# Altium project EVMOMAPL137_Orcad_revg.PrjPcb (part 3 of 4)

## Sheet SH08 - OMAP-L137 EMIF A.SchDoc
size 386 x 246 mm
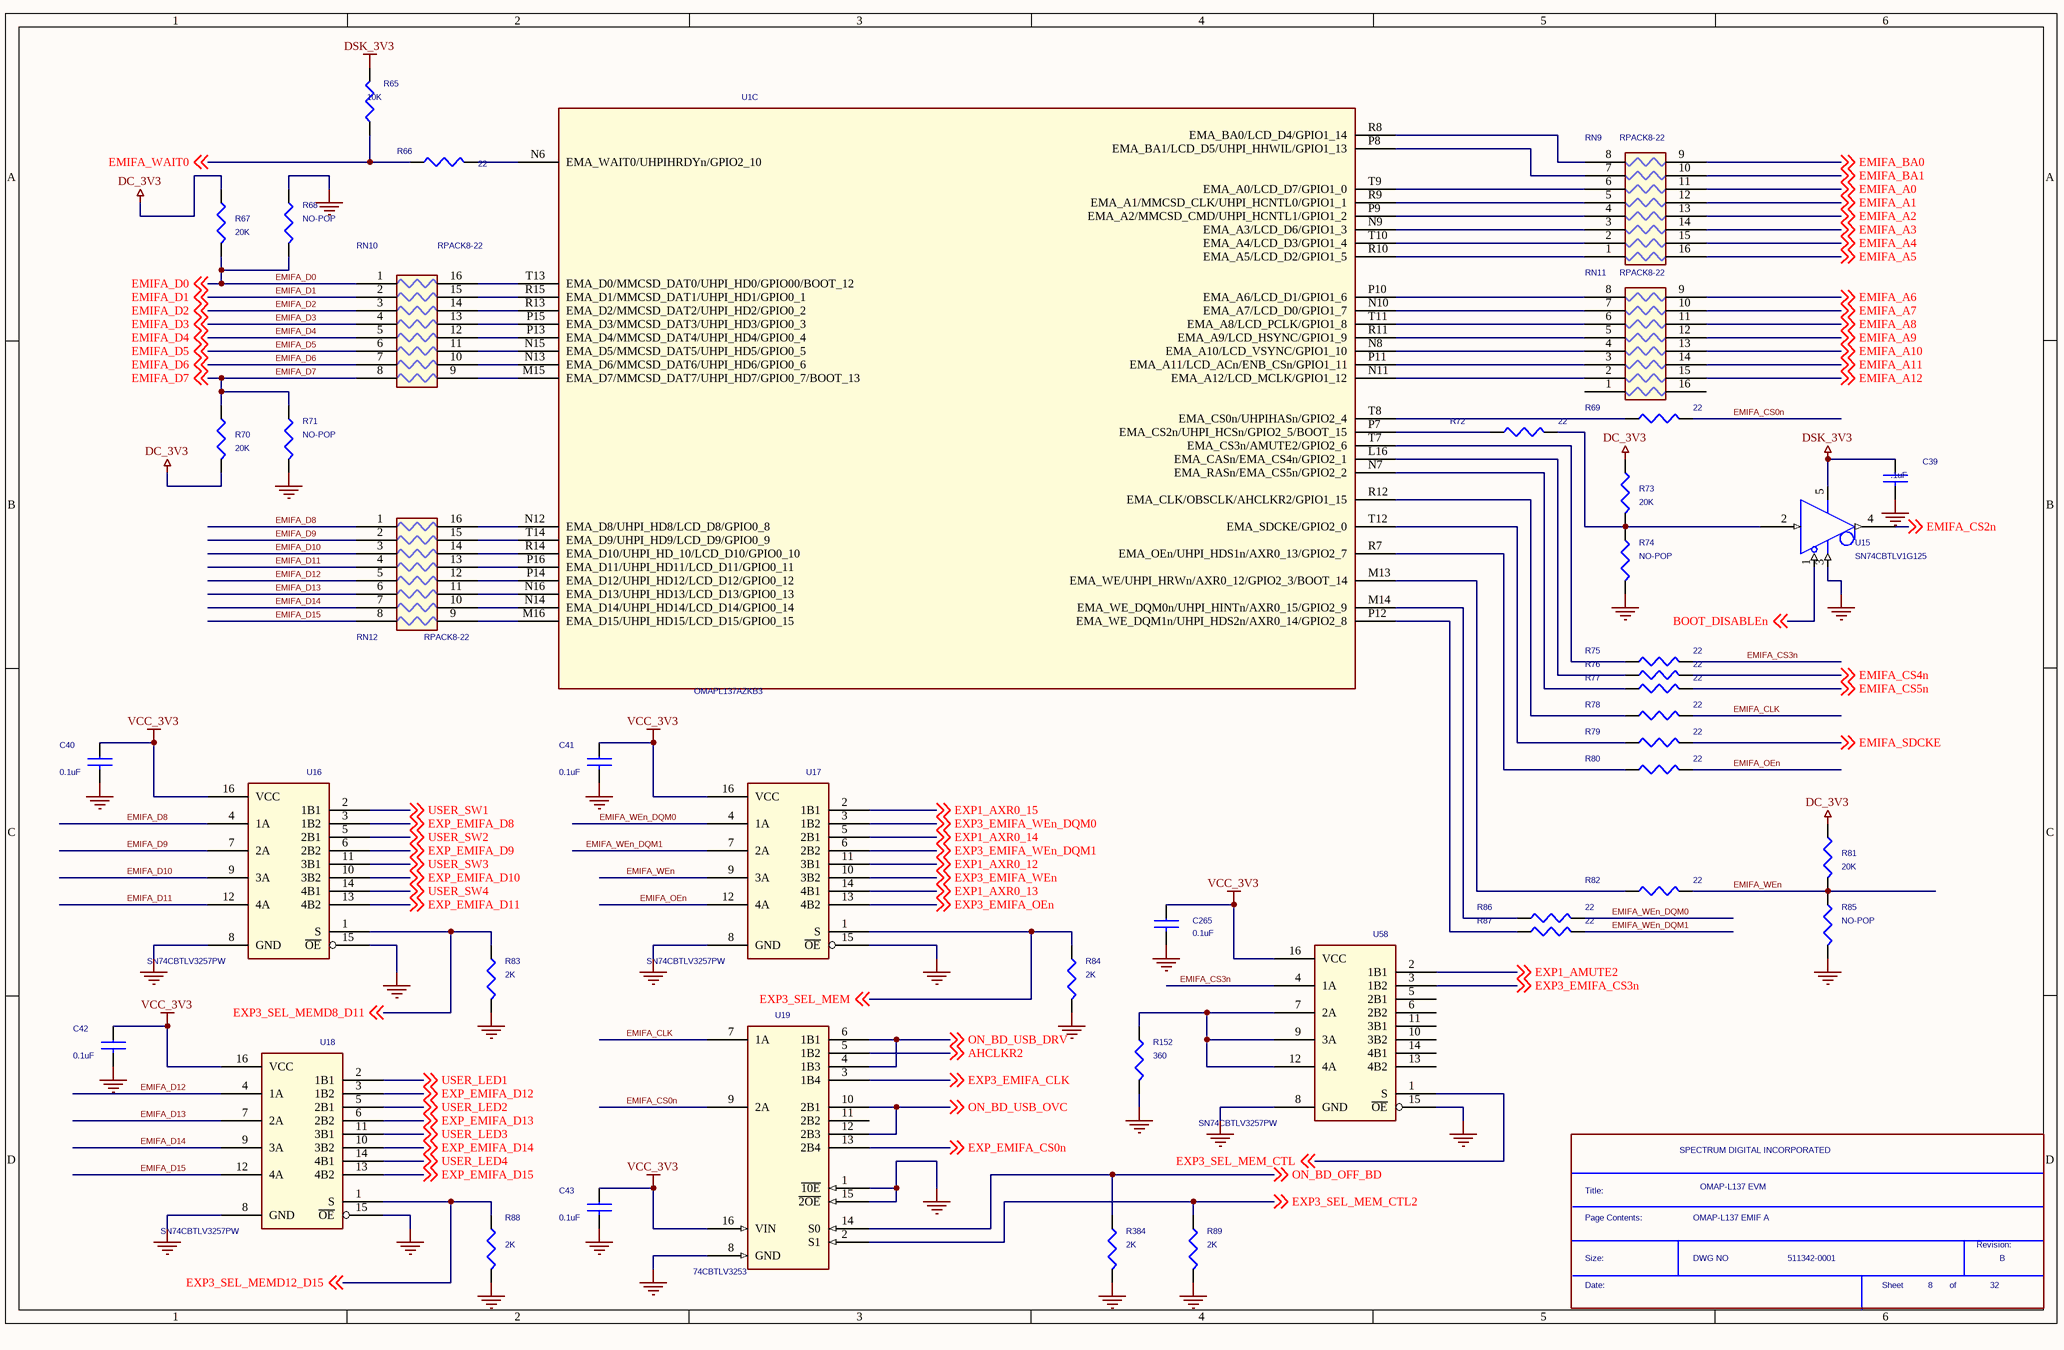
[diagram p24: SH08 - OMAP-L137 EMIF A.SchDoc]

### Parts
(Parts that share a designator on the sheet are numbered #1, #2 ... from top to bottom, then left to right.)
*#25  Page Contents:: OMAP-L137 EMIF A  RevCode: B  Title: OMAP-L137 EVM  OrgName: SPECTRUM DIGITAL INCORPORATED  Doc: 511342-0001  Page Number: 8  Page Count: 32  (hidden comment: SDTitleBlock)  (graphical)
C39  .1uF  [c402-25]
C40  0.1uF  [c402-25]
C41  0.1uF  [c402-25]
C42  0.1uF  [c402-25]
C43  0.1uF  [c402-25]
C265  0.1uF  [c402-25]
R65  10K  [r402-25]
R66  22  [r402-25]
R67  20K  [r402-25]
R68  NO-POP  [r402-25]
R69  22  [r402-25]
R70  20K  [r402-25]
R71  NO-POP  [r402-25]
R72  22  [r402-25]
R73  20K  [r402-25]
R74  NO-POP  [r402-25]
R75  22  [r402-25]
R76  22  [r402-25]
R77  22  [r402-25]
R78  22  [r402-25]
R79  22  [r402-25]
R80  22  [r402-25]
R81  20K  [r402-25]
R82  22  [r402-25]
R83  2K  [r402-25]
R84  2K  [r402-25]
R85  NO-POP  [r402-25]
R86  22  [r402-25]
R87  22  [r402-25]
R88  2K  [r402-25]
R89  2K  [r402-25]
R152  360  [r402-25]
R384  2K  [r402-25]
RN9  RPACK8-22  [rpak16-10x25-2hv]
RN10  RPACK8-22  [rpak16-10x25-2hv]
RN11  RPACK8-22  [rpak16-10x25-2hv]
RN12  RPACK8-22  [rpak16-10x25-2hv]
U1  OMAPL137AZKB3  [skt256-6064]  (part C of 9)
U15  SN74CBTLV1G125  [DCK]
U16  SN74CBTLV3257PW  [TSSOP-16]
U17  SN74CBTLV3257PW  [TSSOP-16]
U18  SN74CBTLV3257PW  [TSSOP-16]
U19  74CBTLV3253  [tssop16-14x70]
U58  SN74CBTLV3257PW  [TSSOP-16]

### Nets
DC_3V3: R67.1 R70.2 R73.1 R81.1
DSK_3V3: C39.1 R65.1 U15.5(VCC)
GND: C39.2 C40.2 C41.2 C42.2 C43.2 C265.2 R68.1 R71.2 R74.2 R83.2 R84.2 R85.2 R88.2 R89.2 R152.2 R384.2 U15.3(GND) U16.8(GND) U16.15(~{OE}) U17.8(GND) U17.15(~{OE}) U18.8(GND) U18.15(~{OE}) U19.1(~{10E}) U19.8(GND) U19.15(~{2OE}) U58.8(GND) U58.15(~{OE})
VCC_3V3: C40.1 C41.1 C42.1 C43.1 C265.1 U16.16(VCC) U17.16(VCC) U18.16(VCC) U19.16(VIN) U58.16(VCC)
AHCLKR2: U19.5(1B2) ; off-sheet AHCLKR2
BOOT_DISABLEn: U15.1(OE) ; off-sheet BOOT_DISABLEn
EMIFA_A0: RN9.11 ; off-sheet EMIFA_A0
EMIFA_A1: RN9.12 ; off-sheet EMIFA_A1
EMIFA_A2: RN9.13 ; off-sheet EMIFA_A2
EMIFA_A3: RN9.14 ; off-sheet EMIFA_A3
EMIFA_A4: RN9.15 ; off-sheet EMIFA_A4
EMIFA_A5: RN9.16 ; off-sheet EMIFA_A5
EMIFA_A6: RN11.9 ; off-sheet EMIFA_A6
EMIFA_A7: RN11.10 ; off-sheet EMIFA_A7
EMIFA_A8: RN11.11 ; off-sheet EMIFA_A8
EMIFA_A9: RN11.12 ; off-sheet EMIFA_A9
EMIFA_A10: RN11.13 ; off-sheet EMIFA_A10
EMIFA_A11: RN11.14 ; off-sheet EMIFA_A11
EMIFA_A12: RN11.15 ; off-sheet EMIFA_A12
EMIFA_BA0: RN9.9 ; off-sheet EMIFA_BA0
EMIFA_BA1: RN9.10 ; off-sheet EMIFA_BA1
EMIFA_CLK: R78.2 U19.7(1A)
EMIFA_CS0n: R69.2 U19.9(2A)
EMIFA_CS2n: U15.4(O) ; off-sheet EMIFA_CS2n
EMIFA_CS3n: R75.2 U58.4(1A)
EMIFA_CS4n: R76.2 ; off-sheet EMIFA_CS4n
EMIFA_CS5n: R77.2 ; off-sheet EMIFA_CS5n
EMIFA_D0: R67.2 R68.2 RN10.1 ; off-sheet EMIFA_D0
EMIFA_D1: RN10.2 ; off-sheet EMIFA_D1
EMIFA_D2: RN10.3 ; off-sheet EMIFA_D2
EMIFA_D3: RN10.4 ; off-sheet EMIFA_D3
EMIFA_D4: RN10.5 ; off-sheet EMIFA_D4
EMIFA_D5: RN10.6 ; off-sheet EMIFA_D5
EMIFA_D6: RN10.7 ; off-sheet EMIFA_D6
EMIFA_D7: R70.1 R71.1 RN10.8 ; off-sheet EMIFA_D7
EMIFA_D8: RN12.1 U16.4(1A)
EMIFA_D9: RN12.2 U16.7(2A)
EMIFA_D10: RN12.3 U16.9(3A)
EMIFA_D11: RN12.4 U16.12(4A)
EMIFA_D12: RN12.5 U18.4(1A)
EMIFA_D13: RN12.6 U18.7(2A)
EMIFA_D14: RN12.7 U18.9(3A)
EMIFA_D15: RN12.8 U18.12(4A)
EMIFA_OEn: R80.2 U17.12(4A)
EMIFA_SDCKE: R79.2 ; off-sheet EMIFA_SDCKE
EMIFA_WAIT0: R65.2 R66.2 ; off-sheet EMIFA_WAIT0
EMIFA_WEn: R81.2 R82.2 R85.1 U17.9(3A)
EMIFA_WEn_DQM0: R86.2 U17.4(1A)
EMIFA_WEn_DQM1: R87.2 U17.7(2A)
EXP1_AMUTE2: U58.2(1B1) ; off-sheet EXP1_AMUTE2
EXP1_AXR0_12: U17.11(3B1) ; off-sheet EXP1_AXR0_12
EXP1_AXR0_13: U17.14(4B1) ; off-sheet EXP1_AXR0_13
EXP1_AXR0_14: U17.5(2B1) ; off-sheet EXP1_AXR0_14
EXP1_AXR0_15: U17.2(1B1) ; off-sheet EXP1_AXR0_15
EXP3_EMIFA_CLK: U19.3(1B4) ; off-sheet EXP3_EMIFA_CLK
EXP3_EMIFA_CS3n: U58.3(1B2) ; off-sheet EXP3_EMIFA_CS3n
EXP3_EMIFA_OEn: U17.13(4B2) ; off-sheet EXP3_EMIFA_OEn
EXP3_EMIFA_WEn: U17.10(3B2) ; off-sheet EXP3_EMIFA_WEn
EXP3_EMIFA_WEn_DQM0: U17.3(1B2) ; off-sheet EXP3_EMIFA_WEn_DQM0
EXP3_EMIFA_WEn_DQM1: U17.6(2B2) ; off-sheet EXP3_EMIFA_WEn_DQM1
EXP3_SEL_MEM: R84.1 U17.1(S) ; off-sheet EXP3_SEL_MEM
EXP3_SEL_MEM_CTL: U58.1(S) ; off-sheet EXP3_SEL_MEM_CTL
EXP3_SEL_MEM_CTL2: R89.1 U19.2(S1) ; off-sheet EXP3_SEL_MEM_CTL2
EXP3_SEL_MEMD8_D11: R83.1 U16.1(S) ; off-sheet EXP3_SEL_MEMD8_D11
EXP3_SEL_MEMD12_D15: R88.1 U18.1(S) ; off-sheet EXP3_SEL_MEMD12_D15
EXP_EMIFA_CS0n: U19.13(2B4) ; off-sheet EXP_EMIFA_CS0n
EXP_EMIFA_D8: U16.3(1B2) ; off-sheet EXP_EMIFA_D8
EXP_EMIFA_D9: U16.6(2B2) ; off-sheet EXP_EMIFA_D9
EXP_EMIFA_D10: U16.10(3B2) ; off-sheet EXP_EMIFA_D10
EXP_EMIFA_D11: U16.13(4B2) ; off-sheet EXP_EMIFA_D11
EXP_EMIFA_D12: U18.3(1B2) ; off-sheet EXP_EMIFA_D12
EXP_EMIFA_D13: U18.6(2B2) ; off-sheet EXP_EMIFA_D13
EXP_EMIFA_D14: U18.10(3B2) ; off-sheet EXP_EMIFA_D14
EXP_EMIFA_D15: U18.13(4B2) ; off-sheet EXP_EMIFA_D15
ON_BD_OFF_BD: R384.1 U19.14(S0) ; off-sheet ON_BD_OFF_BD
ON_BD_USB_DRV: U19.4(1B3) U19.6(1B1) ; off-sheet ON_BD_USB_DRV
ON_BD_USB_OVC: U19.10(2B1) U19.12(2B3) ; off-sheet ON_BD_USB_OVC
USER_LED1: U18.2(1B1) ; off-sheet USER_LED1
USER_LED2: U18.5(2B1) ; off-sheet USER_LED2
USER_LED3: U18.11(3B1) ; off-sheet USER_LED3
USER_LED4: U18.14(4B1) ; off-sheet USER_LED4
USER_SW1: U16.2(1B1) ; off-sheet USER_SW1
USER_SW2: U16.5(2B1) ; off-sheet USER_SW2
USER_SW3: U16.11(3B1) ; off-sheet USER_SW3
USER_SW4: U16.14(4B1) ; off-sheet USER_SW4
NetR66_1: R66.1 U1.N6(EMA_WAIT0/UHPIHRDYn/GPIO2_10)
NetR69_1: R69.1 U1.T8(EMA_CS0n/UHPIHASn/GPIO2_4)
NetR72_1: R72.1 U1.P7(EMA_CS2n/UHPI_HCSn/GPIO2_5/BOOT_15)
NetR72_2: R72.2 R73.2 R74.1 U15.2(I)
NetR75_1: R75.1 U1.T7(EMA_CS3n/AMUTE2/GPIO2_6)
NetR76_1: R76.1 U1.L16(EMA_CASn/EMA_CS4n/GPIO2_1)
NetR77_1: R77.1 U1.N7(EMA_RASn/EMA_CS5n/GPIO2_2)
NetR78_1: R78.1 U1.R12(EMA_CLK/OBSCLK/AHCLKR2/GPIO1_15)
NetR79_1: R79.1 U1.T12(EMA_SDCKE/GPIO2_0)
NetR80_1: R80.1 U1.R7(EMA_OEn/UHPI_HDS1n/AXR0_13/GPIO2_7)
NetR82_1: R82.1 U1.M13(EMA_WE/UHPI_HRWn/AXR0_12/GPIO2_3/BOOT_14)
NetR86_1: R86.1 U1.M14(EMA_WE_DQM0n/UHPI_HINTn/AXR0_15/GPIO2_9)
NetR87_1: R87.1 U1.P12(EMA_WE_DQM1n/UHPI_HDS2n/AXR0_14/GPIO2_8)
NetR152_1: R152.1 U58.7(2A) U58.9(3A) U58.12(4A)
NetRN9_1: RN9.1 U1.R10(EMA_A5/LCD_D2/GPIO1_5)
NetRN9_2: RN9.2 U1.T10(EMA_A4/LCD_D3/GPIO1_4)
NetRN9_3: RN9.3 U1.N9(EMA_A3/LCD_D6/GPIO1_3)
NetRN9_4: RN9.4 U1.P9(EMA_A2/MMCSD_CMD/UHPI_HCNTL1/GPIO1_2)
NetRN9_5: RN9.5 U1.R9(EMA_A1/MMCSD_CLK/UHPI_HCNTL0/GPIO1_1)
NetRN9_6: RN9.6 U1.T9(EMA_A0/LCD_D7/GPIO1_0)
NetRN9_7: RN9.7 U1.P8(EMA_BA1/LCD_D5/UHPI_HHWIL/GPIO1_13)
NetRN9_8: RN9.8 U1.R8(EMA_BA0/LCD_D4/GPIO1_14)
NetRN10_9: RN10.9 U1.M15(EMA_D7/MMCSD_DAT7/UHPI_HD7/GPIO0_7/BOOT_13)
NetRN10_10: RN10.10 U1.N13(EMA_D6/MMCSD_DAT6/UHPI_HD6/GPIO0_6)
NetRN10_11: RN10.11 U1.N15(EMA_D5/MMCSD_DAT5/UHPI_HD5/GPIO0_5)
NetRN10_12: RN10.12 U1.P13(EMA_D4/MMCSD_DAT4/UHPI_HD4/GPIO0_4)
NetRN10_13: RN10.13 U1.P15(EMA_D3/MMCSD_DAT3/UHPI_HD3/GPIO0_3)
NetRN10_14: RN10.14 U1.R13(EMA_D2/MMCSD_DAT2/UHPI_HD2/GPIO0_2)
NetRN10_15: RN10.15 U1.R15(EMA_D1/MMCSD_DAT1/UHPI_HD1/GPIO0_1)
NetRN10_16: RN10.16 U1.T13(EMA_D0/MMCSD_DAT0/UHPI_HD0/GPIO00/BOOT_12)
NetRN11_2: RN11.2 U1.N11(EMA_A12/LCD_MCLK/GPIO1_12)
NetRN11_3: RN11.3 U1.P11(EMA_A11/LCD_ACn/ENB_CSn/GPIO1_11)
NetRN11_4: RN11.4 U1.N8(EMA_A10/LCD_VSYNC/GPIO1_10)
NetRN11_5: RN11.5 U1.R11(EMA_A9/LCD_HSYNC/GPIO1_9)
NetRN11_6: RN11.6 U1.T11(EMA_A8/LCD_PCLK/GPIO1_8)
NetRN11_7: RN11.7 U1.N10(EMA_A7/LCD_D0/GPIO1_7)
NetRN11_8: RN11.8 U1.P10(EMA_A6/LCD_D1/GPIO1_6)
NetRN12_9: RN12.9 U1.M16(EMA_D15/UHPI_HD15/LCD_D15/GPIO0_15)
NetRN12_10: RN12.10 U1.N14(EMA_D14/UHPI_HD14/LCD_D14/GPIO0_14)
NetRN12_11: RN12.11 U1.N16(EMA_D13/UHPI_HD13/LCD_D13/GPIO0_13)
NetRN12_12: RN12.12 U1.P14(EMA_D12/UHPI_HD12/LCD_D12/GPIO0_12)
NetRN12_13: RN12.13 U1.P16(EMA_D11/UHPI_HD11/LCD_D11/GPIO0_11)
NetRN12_14: RN12.14 U1.R14(EMA_D10/UHPI_HD_10/LCD_D10/GPIO0_10)
NetRN12_15: RN12.15 U1.T14(EMA_D9/UHPI_HD9/LCD_D9/GPIO0_9)
NetRN12_16: RN12.16 U1.N12(EMA_D8/UHPI_HD8/LCD_D8/GPIO0_8)

Not connected (* = marked no-connect by the designer): RN11 1 16; U19 11(2B2); U58 5(2B1) 6(2B2) 10(3B2) 11(3B1) 13(4B2) 14(4B1)

### Notes on the sheet
- (in symbol SDTitleBlock) Title:; Page Contents:; Revision:; Size:; DWG NO; Date:; Sheet; of

### Library data of the parts
C39 C265 = CAP NP_2: Part #: 101587-1100R
C40-C43 = CAP NP: Part #: 101587-1100R
R65 = R: Part #: 101370-1003R
R66 R69 R72 R75-R80 R82 R86 R87 = R: Part #: 101370-2200R
R67 R70 R73 R81 = R_1: Part #: 101370-2003R
R68 R71 R74 R85 = R_1: Part #: R0402-NOPOP
R83 R84 R88 R89 R384 = R: Part #: 101370-2002R
R152 = R: Part #: 101370-3601R
RN9-RN12 = RESISTOR DIP 8_0: Part #: 101069-2200R
U1 = PRIMUS_BGA_1: Part #: 102772-0001; SWAP_INFO: (S1+S2+S3+S4+S5+S6+S7+S8+S9); SPLIT_INST: TRUE
U15 = SN74LVC1G125: Part #: 101689-0125R
U16-U18 U58 = SN74CBT3257PW: IC, Quad 2-1 Multiplexer; Part #: 101670-0001R; Mfg: TI
U19 = 74CBTLV253_0: Part #: 101433-0001R

## Sheet SH07 - OMAP-L137 USB1.SchDoc
size 386 x 246 mm
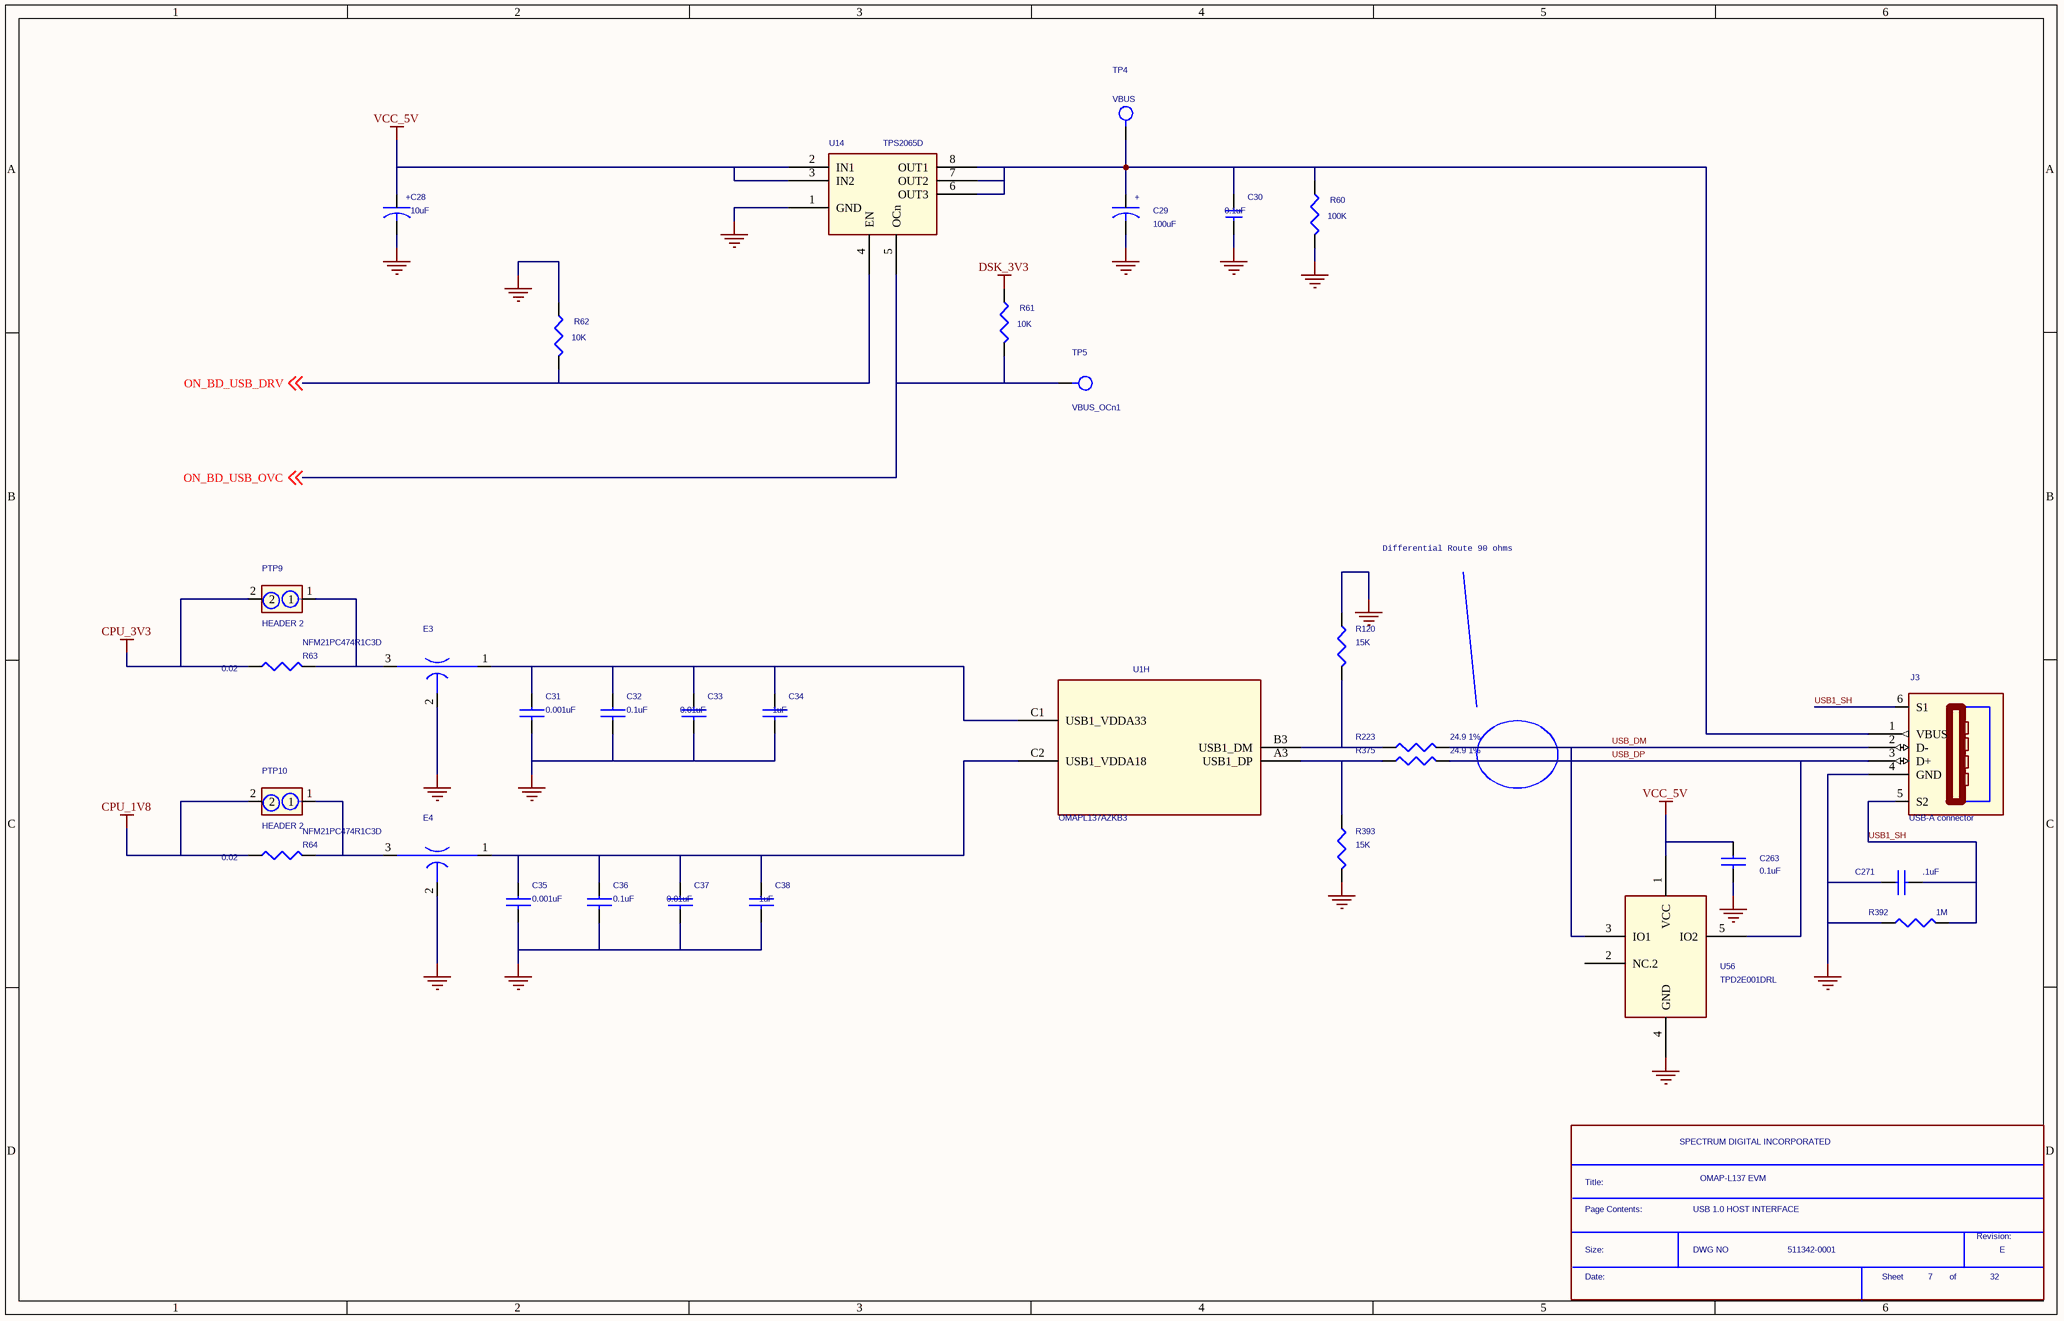
[diagram p25: SH07 - OMAP-L137 USB1.SchDoc]

### Parts
(Parts that share a designator on the sheet are numbered #1, #2 ... from top to bottom, then left to right.)
*#26  Page Contents:: USB 1.0 HOST INTERFACE  RevCode: E  Title: OMAP-L137 EVM  OrgName: SPECTRUM DIGITAL INCORPORATED  Doc: 511342-0001  Page Number: 7  Page Count: 32  (hidden comment: SDTitleBlock)  (graphical)
C28  10uF  [EIA-A]
C29  100uF  [EIA-A]
C30  0.1uF  [0603]
C31  0.001uF  [c402-25]
C32  0.1uF  [c402-25]
C33  0.01uF  [c402-25]
C34  1uF  [c603-35x45]
C35  0.001uF  [c402-25]
C36  0.1uF  [c402-25]
C37  0.01uF  [c402-25]
C38  1uF  [c603-35x45]
C263  0.1uF  [c402-25]
C271  .1uF  [C0603]
E3  NFM21PC474R1C3D  [emi-NFM21p]
E4  NFM21PC474R1C3D  [emi-NFM21p]
J3  USB-A connector  [USB-B]
PTP9  HEADER 2  [JUMP1X2-6040]
PTP10  HEADER 2  [JUMP1X2-6040]
R60  100K  [r402-25]
R61  10K  [r402-25]
R62  10K  [r402-25]
R63  0.02  [r1206-40x70]
R64  0.02  [r1206-40x70]
R120  15K  [r402-25]
R223  24.9 1%  [r402-25]
R375  24.9 1%  [r402-25]
R392  1M  [r603-35x45]
R393  15K  [r402-25]
TP4  VBUS  [tp1-6040]
TP5  VBUS_OCn1  [tp1-6040]
U1  OMAPL137AZKB3  [skt256-6064]  (part H of 9)
U14  TPS2065D  [so8-25x75]
U56  TPD2E001DRL  [drl5-12x40]

### Nets
CPU_1V8: PTP10.2 R64.2
CPU_3V3: PTP9.2 R63.2
DSK_3V3: R61.1
GND: C28.2 C29.2 C30.2 C31.2 C32.2 C33.2 C34.2 C35.2 C36.2 C37.2 C38.2 C263.2 C271.1 E3.2 E4.2 J3.4(GND) R60.2 R62.1 R120.1 R392.1 R393.2 U14.1(GND) U56.4(GND)
VCC_5V: C28.1 C263.1 U14.2(IN1) U14.3(IN2) U56.1(VCC)
ON_BD_USB_DRV: R62.2 U14.4(EN) ; off-sheet ON_BD_USB_DRV
ON_BD_USB_OVC: R61.2 TP5.1(PIN) U14.5(OCn) ; off-sheet ON_BD_USB_OVC
USB1_SH: C271.2 J3.5(S2) J3.6(S1) R392.2
USB_DM: J3.2(D-) R223.2 U56.3(IO1)
USB_DP: J3.3(D+) R375.2 U56.5(IO2)
NetC29_1: C29.1 C30.1 J3.1(VBUS) R60.1 TP4.1(PIN) U14.6(OUT3) U14.7(OUT2) U14.8(OUT1)
NetC31_1: C31.1 C32.1 C33.1 C34.1 E3.1 U1.C1(USB1_VDDA33)
NetC35_1: C35.1 C36.1 C37.1 C38.1 E4.1 U1.C2(USB1_VDDA18)
NetE3_3: E3.3 PTP9.1 R63.1
NetE4_3: E4.3 PTP10.1 R64.1
NetR120_2: R120.2 R223.1 U1.B3(USB1_DM)
NetR375_1: R375.1 R393.1 U1.A3(USB1_DP)

Not connected (* = marked no-connect by the designer): U56 2(NC.2)

### Notes on the sheet
- Differential Route 90 ohms
- (in symbol Cap 4_1.7uF Tan 10V 20% EIA_A) +
- (in symbol SDTitleBlock) Title:; Page Contents:; Revision:; Size:; DWG NO; Date:; Sheet; of

### Library data of the parts
C28 = Cap 4_1.7uF Tan 10V 20% EIA_A: 4.7uF Capacitor, Tantalum, 10V, 20%; NCPartnumber: EIA_A; Mfr: Panasonic; PartName: Cap 4.7uF Tan 10V 20% EIA_A; MfrNum: ECS-T1AY475R; Part #: 101003-0101R; Cost10K: 0.257; Cost100: 0.418; Vendor: xxxx; VendorNum: PCS2475CT-ND; SD PCB Footprint: EIA1206
C29 = Cap 4_1.7uF Tan 10V 20% EIA_A: 4.7uF Capacitor, Tantalum, 10V, 20%; NCPartnumber: EIA_A; Mfr: Panasonic; PartName: Cap 4.7uF Tan 10V 20% EIA_A; MfrNum: ECS-T1AY475R; Part #: 101608-0102R; Cost10K: 0.257; Cost100: 0.418; Vendor: xxxx; VendorNum: PCS2475CT-ND; SD PCB Footprint: EIA1206
C30 = Cap 100nF Cermc 16V 10% 603: 0.1uF Capacitor, Ceramic, 16V, 10%, 0603; MfrNum: ECJ-1VB1C104K; Mfr: Panasonic; NCPartnumber: 1C0056; Part #: 101587-1100R; VendorNum: PCC1762CT-ND; Vendor: Digikey; Cost100: 0.0694; Cost10K: 0.038; TI Footprint: c603-35x45; SD PCB Footprint: EIA0402; PartName: Cap 100nF Cermc 16V 10% 603
C31 C35 = CAP NP: Part #: 102058-1102R
C32 C36 = CAP NP: Part #: 101587-1100R
C33 C37 = CAP NP: Part #: 101587-1101R
C34 C38 = CAP NP: Part #: 101007-0100R
C263 = CAP NP_0: Part #: 101587-1100R
C271 = CAP .1 uF 10% 0603: Part #: 101587-1100R
E3 E4 = NFM_1: Part #: 102569-1470R
J3 = USB-A connector: USB Device Connector Right Angle PCB Mount; PartName: USB  Connector; Mfr: AMP; MfrNum: 787780-1; Part #: 101678-0001R; Vendor: Digikey; VendorNum: 787780-1-ND
PTP9 PTP10 = PTP2: Single Line Header 2pin Tin; NCPartnumber: 2H0000; MfrNum: PTC02SAAN; Mfr: Sullins; Cost10K: 0.252; Vendor: Digikey; Cost100: 0.252; PartName: HEADER2Pin
R60 = R: Part #: 101370-1004R
R61 R62 = R: Part #: 101370-1003R
R63 R64 = R: Part #: 102598-0002R
R120 R393 = R
R223 R375 = R: Part #: 102145-2490R
R392 = R: Part #: 100642-1005R
TP4 = Test Point_1: TEST POINT 0.100; PartName: HEADER 1; Part #: 100115-0001R; Mfr: Sullins; MfrNum: PZC36DAAN; Vendor: Digikey; Vendor Nbr: S2111-36-ND; SD PCB Footprint: CON1; Assy_NO-POP: Do Not Populate; VendorNum: S2011-36-ND; Cost100: 0.031; Cost10K: 0.018; ION Footprint: tp1-6040; TI Footprint: tp1-6040
TP5 = Test Point_1: TEST POINT 0.100; PartName: HEADER 1; MfrNum: PZC36DAAN; Mfr: Sullins; Part #: 100115-0001R; Vendor: Digikey; Vendor Nbr: S2111-36-ND; Cost10K: 0.018; Cost100: 0.031; VendorNum: S2011-36-ND; Assy_NO-POP: Do Not Populate; SD PCB Footprint: CON1; TI Footprint: tp1-6040; ION Footprint: tp1-6040
U1 = PRIMUS_BGA_1: as U1 on sheet SH08 - OMAP-L137 EMIF A
U14 = tps2061_1: Part #: 102810-0001R
U56 = TPDE0001RSE_0: Part #: 102728-0001R

## Sheet SH06 - OMAP-L137 USB2.SchDoc
size 386 x 246 mm
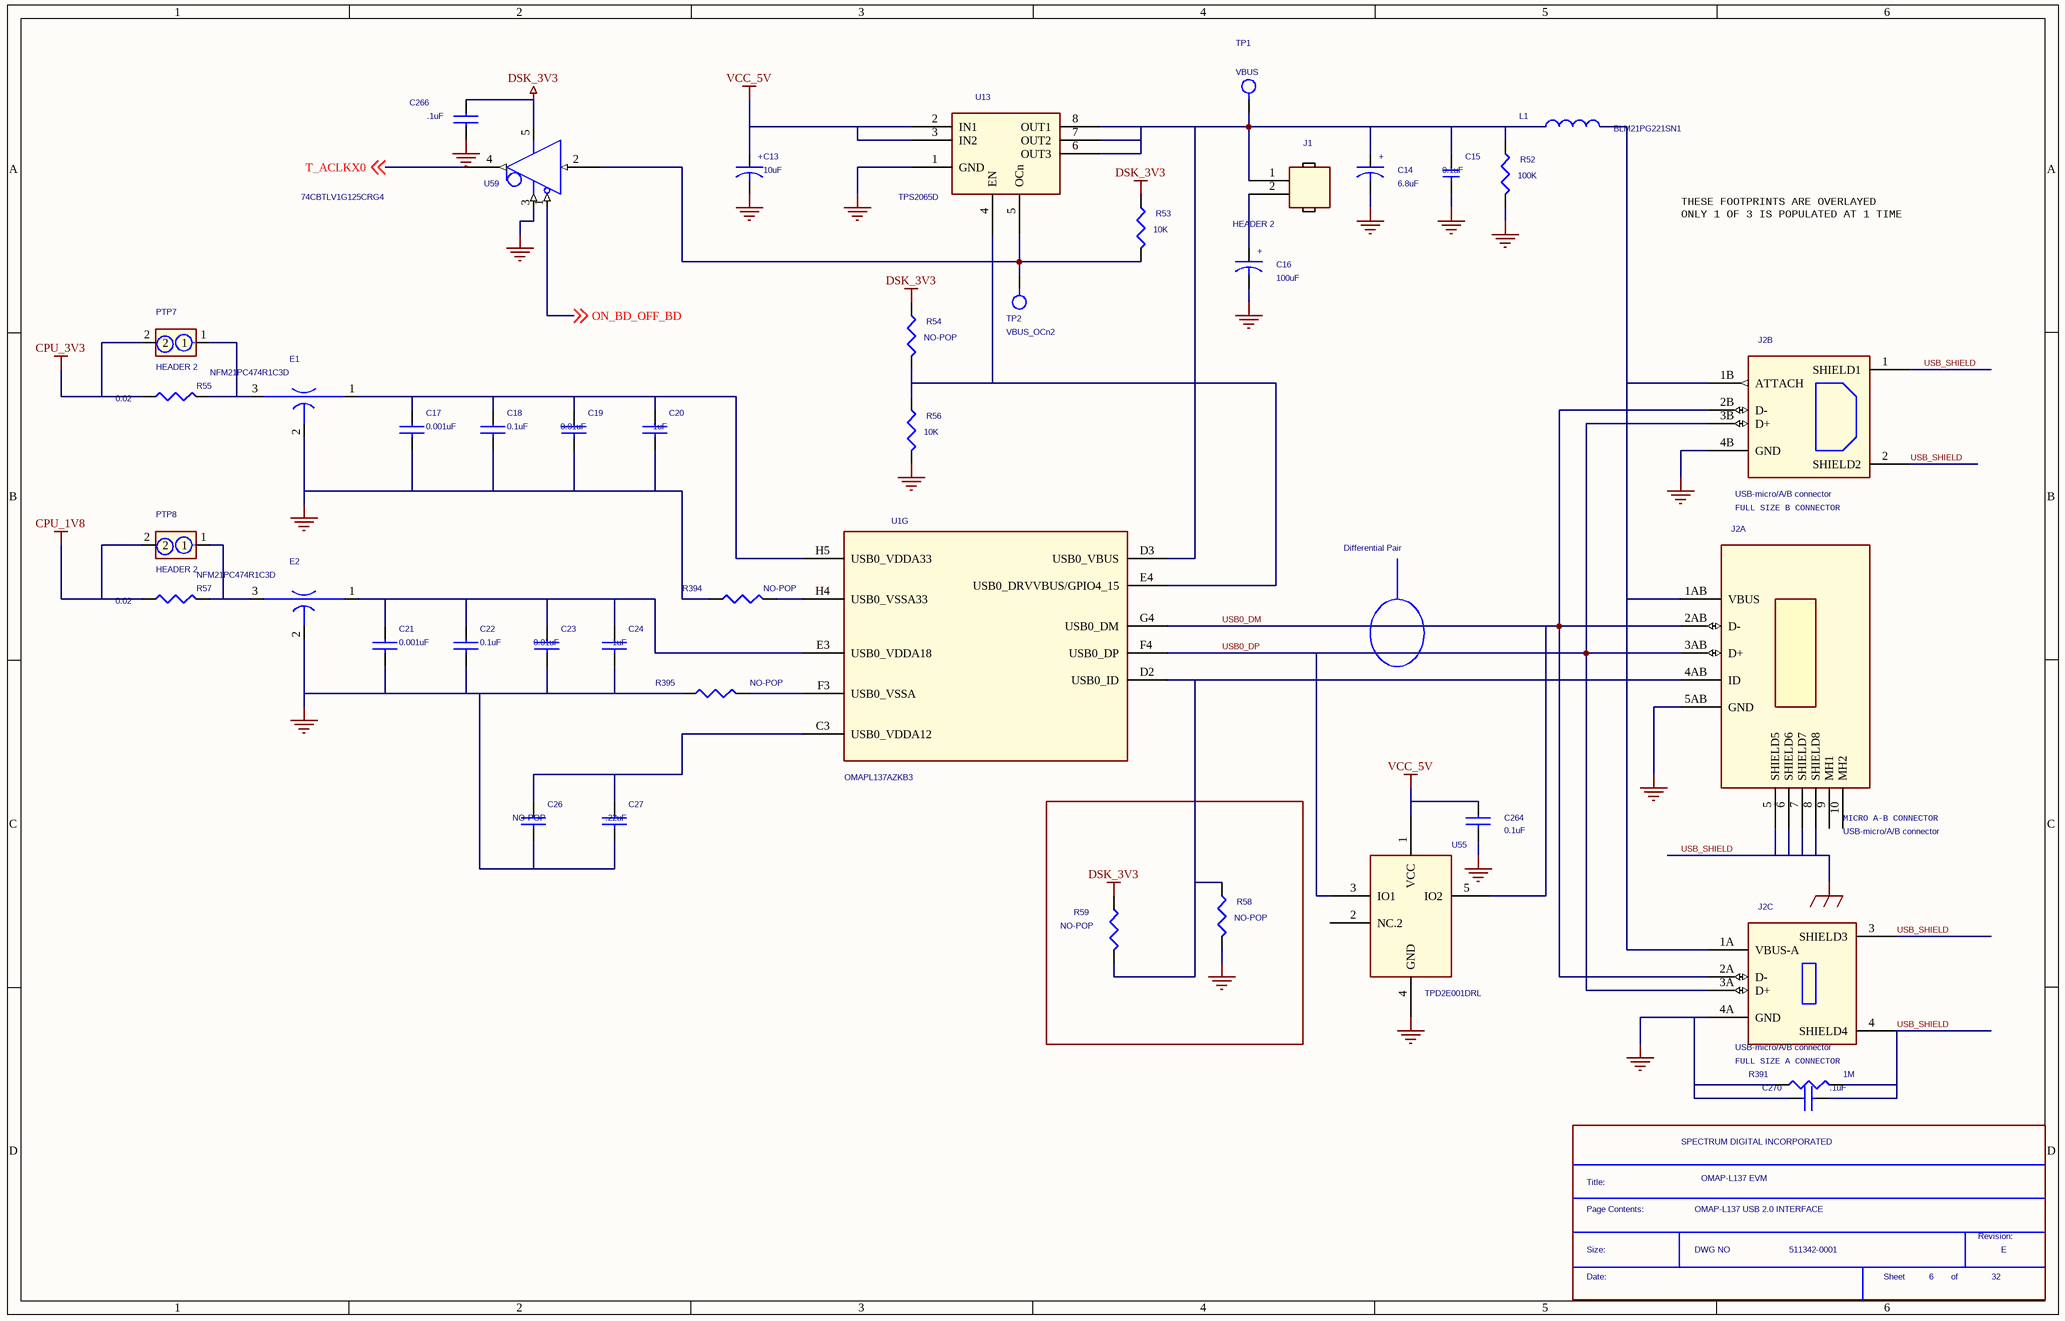
[diagram p26: SH06 - OMAP-L137 USB2.SchDoc]

### Parts
(Parts that share a designator on the sheet are numbered #1, #2 ... from top to bottom, then left to right.)
*#27  Page Contents:: OMAP-L137 USB 2.0 INTERFACE  RevCode: E  Title: OMAP-L137 EVM  OrgName: SPECTRUM DIGITAL INCORPORATED  Doc: 511342-0001  Page Number: 6  Page Count: 32  (hidden comment: SDTitleBlock)  (graphical)
C13  10uF  [EIA-A]
C14  6.8uF  [EIA-A]
C15  0.1uF  [0603]
C16  100uF  [EIA-A]
C17  0.001uF  [c402-25]
C18  0.1uF  [c402-25]
C19  0.01uF  [c402-25]
C20  1uF  [c603-35x45]
C21  0.001uF  [c402-25]
C22  0.1uF  [c402-25]
C23  0.01uF  [c402-25]
C24  1uF  [c603-35x45]
C26  NO-POP  [c402-25]
C27  .22uF  [c603-35x45]
C264  0.1uF  [c402-25]
C266  .1uF  [c402-25]
C270  .1uF  [C0603]
E1  NFM21PC474R1C3D  [emi-NFM21p]
E2  NFM21PC474R1C3D  [emi-NFM21p]
J1  HEADER 2  [JUMP1X2-6040]
J2  USB-micro/A/B connector  [usb_tripl-rev2]  (parts A,B,C of 3)
L1  BLM21PG221SN1  [l805-35x60]
PTP7  HEADER 2  [JUMP1X2-6040]
PTP8  HEADER 2  [JUMP1X2-6040]
R52  100K  [r402-25]
R53  10K  [r402-25]
R54  NO-POP  [r402-25]
R55  0.02  [r1206-40x70]
R56  10K  [r402-25]
R57  0.02  [r1206-40x70]
R58  NO-POP  [r402-25]
R59  NO-POP  [r402-25]
R391  1M  [r603-35x45]
R394  NO-POP  [r402-25]
R395  NO-POP  [r402-25]
TP1  VBUS  [tp1-6040]
TP2  VBUS_OCn2  [tp1-6040]
U1  OMAPL137AZKB3  [skt256-6064]  (part G of 9)
U13  TPS2065D  [so8-25x75]
U55  TPD2E001DRL  [drl5-12x40]
U59  74CBTLV1G125CRG4  [DCK]

### Nets
CPU_1V8: PTP8.2 R57.2
CPU_3V3: PTP7.2 R55.2
DSK_3V3: C266.1 R53.1 R54.1 R59.1 U59.5(VCC)
GND: C13.2 C14.2 C15.2 C16.2 C17.2 C18.2 C19.2 C20.2 C21.2 C22.2 C23.2 C24.2 C26.2 C27.2 C264.2 C266.2 C270.1 E1.2 E2.2 J2.4A(GND) J2.4B(GND) J2.5AB(GND) R52.2 R56.2 R58.2 R391.1 R394.1 R395.1 U13.1(GND) U55.4(GND) U59.3(GND)
USB_SHIELD: C270.2 J2.1(SHIELD1) J2.2(SHIELD2) J2.3(SHIELD3) J2.4(SHIELD4) J2.5(SHIELD5) J2.6(SHIELD6) J2.7(SHIELD7) J2.8(SHIELD8) R391.2  [also labelled GND_EARTH]
VCC_5V: C13.1 C264.1 U13.2(IN1) U13.3(IN2) U55.1(VCC)
ON_BD_OFF_BD: U59.1(OE) ; off-sheet ON_BD_OFF_BD
T_ACLKX0: U59.4(O) ; off-sheet T_ACLKX0
USB0_DM: J2.2A(D-) J2.2AB(D-) J2.2B(D-) U1.G4(USB0_DM) U55.5(IO2)
USB0_DP: J2.3A(D+) J2.3AB(D+) J2.3B(D+) U1.F4(USB0_DP) U55.3(IO1)
NetC14_1: C14.1 C15.1 J1.1 L1.2 R52.1 TP1.1(PIN) U1.D3(USB0_VBUS) U13.6(OUT3) U13.7(OUT2) U13.8(OUT1)
NetC16_1: C16.1 J1.2
NetC17_1: C17.1 C18.1 C19.1 C20.1 E1.1 U1.H5(USB0_VDDA33)
NetC21_1: C21.1 C22.1 C23.1 C24.1 E2.1 U1.E3(USB0_VDDA18)
NetC26_1: C26.1 C27.1 U1.C3(USB0_VDDA12)
NetE1_3: E1.3 PTP7.1 R55.1
NetE2_3: E2.3 PTP8.1 R57.1
NetJ2_1A: J2.1A(VBUS-A) J2.1AB(VBUS) J2.1B(ATTACH) L1.1
NetJ2_4AB: J2.4AB(ID) R58.1 R59.2 U1.D2(USB0_ID)
NetR53_2: R53.2 TP2.1(PIN) U13.5(OCn) U59.2(I)
NetR54_2: R54.2 R56.1 U1.E4(USB0_DRVVBUS/GPIO4_15) U13.4(EN)
NetR394_2: R394.2 U1.H4(USB0_VSSA33)
NetR395_2: R395.2 U1.F3(USB0_VSSA)

Not connected (* = marked no-connect by the designer): J2 9(MH1) 10(MH2); U55 2(NC.2)

### Notes on the sheet
- THESE FOOTPRINTS ARE OVERLAYED
  ONLY 1 OF 3 IS POPULATED AT 1 TIME
- (near J2) FULL SIZE B CONNECTOR
- Differential Pair
- (near J2) MICRO A-B CONNECTOR
- FULL SIZE A CONNECTOR
- (in symbol Cap 4_1.7uF Tan 10V 20% EIA_A) +
- (in symbol SDTitleBlock) Title:; Page Contents:; Revision:; Size:; DWG NO; Date:; Sheet; of

### Library data of the parts
C13 = Cap 4_1.7uF Tan 10V 20% EIA_A: as C28 on sheet SH07 - OMAP-L137 USB1
C14 = Cap 4_1.7uF Tan 10V 20% EIA_A: 4.7uF Capacitor, Tantalum, 10V, 20%; NCPartnumber: EIA_A; Mfr: Panasonic; PartName: Cap 4.7uF Tan 10V 20% EIA_A; MfrNum: ECS-T1AY475R; Part #: 102359-0680R; Cost10K: 0.257; Cost100: 0.418; Vendor: xxxx; VendorNum: PCS2475CT-ND; SD PCB Footprint: EIA1206
C15 = Cap 100nF Cermc 16V 10% 603: as C30 on sheet SH07 - OMAP-L137 USB1; PartName: Cap 100nF Cermc 16V 10% 603
C16 = Cap 4_1.7uF Tan 10V 20% EIA_A: as C29 on sheet SH07 - OMAP-L137 USB1
C17 C21 = CAP NP: Part #: 102058-1102R
C18 C22 = CAP NP: Part #: 101587-1100R
C19 C23 = CAP NP: Part #: 101587-1101R
C20 C24 = CAP NP: Part #: 101007-0100R
C26 = CAP NP: Part #: C0402-NOPOP
C27 = CAP NP: Part #: 101005-1220R
C264 = CAP NP_0: Part #: 101587-1100R
C266 = CAP NP_2: Part #: 101587-1100R
C270 = CAP .1 uF 10% 0603: Part #: 101587-1100R
E1 E2 = NFM_1: Part #: 102569-1470R
J1 = HEADER 2: Part #: 100115-0002R
J2 = USBCONN3_0: Part #: 102836-0001R
L1 = INDUCTOR_3: Part #: 101228-2201R
PTP7 PTP8 = PTP2: as PTP9 on sheet SH07 - OMAP-L137 USB1; Cost100: 0.252; PartName: HEADER2Pin
R52 = R: Part #: 101370-1004R
R53 R56 = R: Part #: 101370-1003R
R54 R58 R59 = R: Part #: R0402-NOPOP
R55 R57 = R: Part #: 102598-0002R
R391 = R: Part #: 100642-1005R
R394 R395 = R
TP1 = Test Point_1: as TP5 on sheet SH07 - OMAP-L137 USB1; TI Footprint: tp1-6040; ION Footprint: tp1-6040
TP2 = Test Point_1: as TP4 on sheet SH07 - OMAP-L137 USB1; ION Footprint: tp1-6040; TI Footprint: tp1-6040
U1 = PRIMUS_BGA_1: as U1 on sheet SH08 - OMAP-L137 EMIF A
U13 = tps2061_1: Part #: 102810-0001R
U55 = TPDE0001RSE_0: Part #: 102728-0001R
U59 = SN74LVC1G125: Part #: 101689-0125R

## Sheet SH05 - SPI MUXING.SchDoc
size 386 x 246 mm
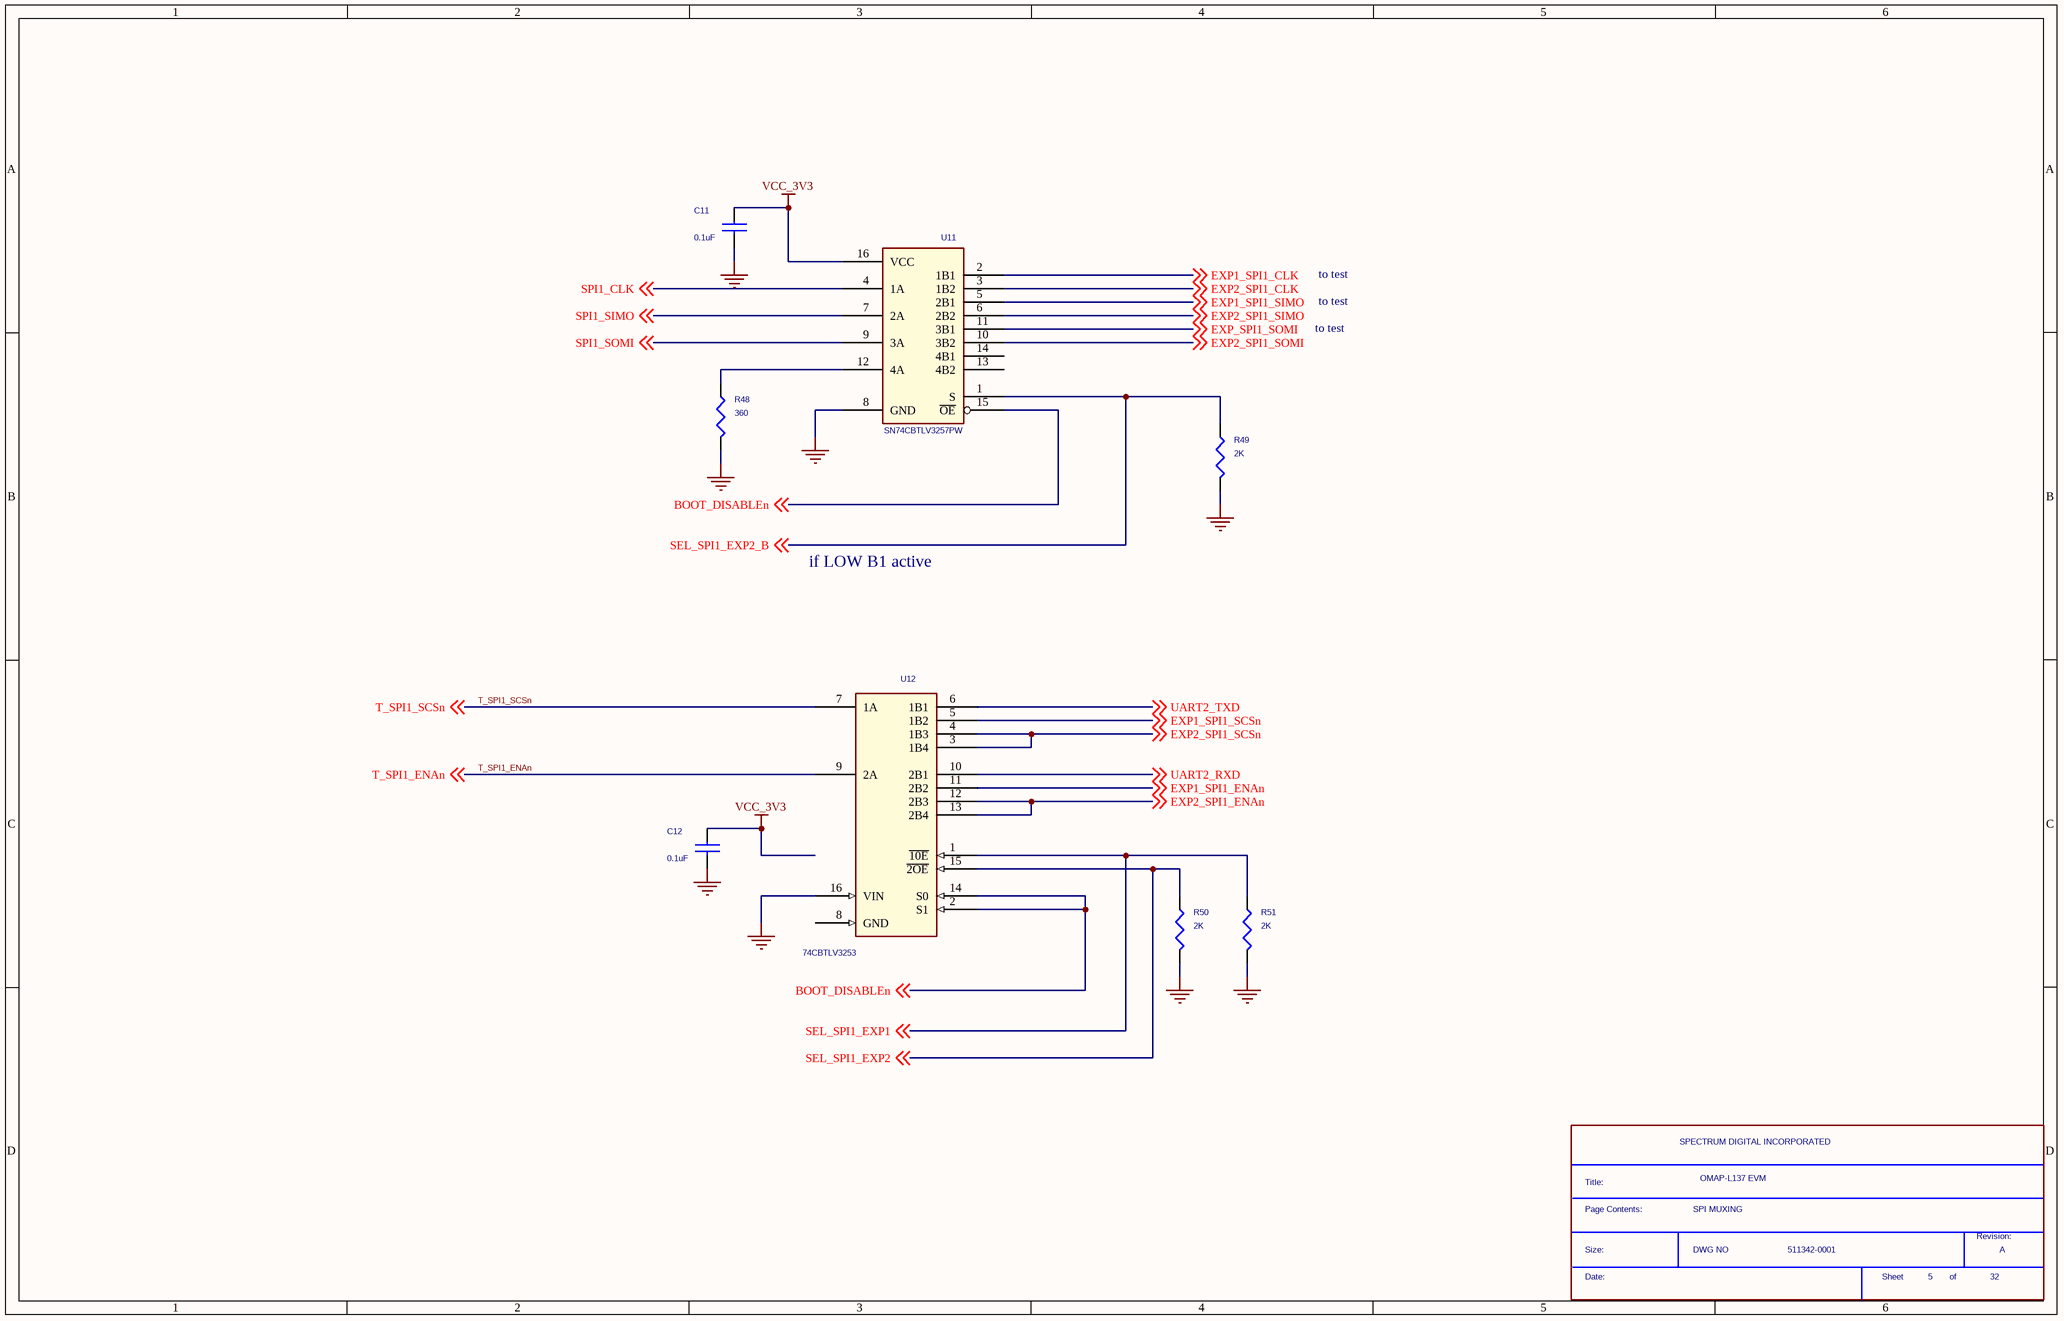
[diagram p27: SH05 - SPI MUXING.SchDoc]

### Parts
(Parts that share a designator on the sheet are numbered #1, #2 ... from top to bottom, then left to right.)
*#28  Page Contents:: SPI MUXING  RevCode: A  Title: OMAP-L137 EVM  OrgName: SPECTRUM DIGITAL INCORPORATED  Doc: 511342-0001  Page Number: 5  Page Count: 32  (hidden comment: SDTitleBlock)  (graphical)
C11  0.1uF  [c402-25]
C12  0.1uF  [c402-25]
R48  360  [r402-25]
R49  2K  [r402-25]
R50  2K  [r402-25]
R51  2K  [r402-25]
U11  SN74CBTLV3257PW  [TSSOP-16]
U12  74CBTLV3253  [tssop16-14x70]

### Nets
GND: C11.2 C12.2 R48.2 R49.2 R50.2 R51.2 U11.8(GND) U12.16(VIN)
VCC_3V3: C11.1 C12.1 U11.16(VCC)
BOOT_DISABLEn: U11.15(~{OE}) U12.2(S1) U12.14(S0) ; off-sheet BOOT_DISABLEn
EXP1_SPI1_CLK: U11.2(1B1) ; off-sheet EXP1_SPI1_CLK
EXP1_SPI1_ENAn: U12.11(2B2) ; off-sheet EXP1_SPI1_ENAn
EXP1_SPI1_SCSn: U12.5(1B2) ; off-sheet EXP1_SPI1_SCSn
EXP1_SPI1_SIMO: U11.5(2B1) ; off-sheet EXP1_SPI1_SIMO
EXP2_SPI1_CLK: U11.3(1B2) ; off-sheet EXP2_SPI1_CLK
EXP2_SPI1_ENAn: U12.12(2B3) U12.13(2B4) ; off-sheet EXP2_SPI1_ENAn
EXP2_SPI1_SCSn: U12.3(1B4) U12.4(1B3) ; off-sheet EXP2_SPI1_SCSn
EXP2_SPI1_SIMO: U11.6(2B2) ; off-sheet EXP2_SPI1_SIMO
EXP2_SPI1_SOMI: U11.10(3B2) ; off-sheet EXP2_SPI1_SOMI
EXP_SPI1_SOMI: U11.11(3B1) ; off-sheet EXP_SPI1_SOMI
SEL_SPI1_EXP1: R51.1 U12.1(~{10E}) ; off-sheet SEL_SPI1_EXP1
SEL_SPI1_EXP2: R50.1 U12.15(~{2OE}) ; off-sheet SEL_SPI1_EXP2
SEL_SPI1_EXP2_B: R49.1 U11.1(S) ; off-sheet SEL_SPI1_EXP2_B
SPI1_CLK: U11.4(1A) ; off-sheet SPI1_CLK  [project net BOOTMODE[7]]
SPI1_SIMO: U11.7(2A) ; off-sheet SPI1_SIMO
SPI1_SOMI: U11.9(3A) ; off-sheet SPI1_SOMI
T_SPI1_ENAn: U12.9(2A) ; off-sheet T_SPI1_ENAn
T_SPI1_SCSn: U12.7(1A) ; off-sheet T_SPI1_SCSn
UART2_RXD: U12.10(2B1) ; off-sheet UART2_RXD
UART2_TXD: U12.6(1B1) ; off-sheet UART2_TXD
NetR48_1: R48.1 U11.12(4A)

Not connected (* = marked no-connect by the designer): U11 13(4B2) 14(4B1); U12 8(GND)

### Notes on the sheet
- to test
- if LOW B1 active
- (in symbol SDTitleBlock) Title:; Page Contents:; Revision:; Size:; DWG NO; Date:; Sheet; of

### Library data of the parts
C11 C12 = CAP NP: Part #: 101587-1100R
R48 = R: Part #: 101370-3601R
R49-R51 = R: Part #: 101370-2002R
U11 = SN74CBT3257PW: as U16 on sheet SH08 - OMAP-L137 EMIF A
U12 = 74CBTLV253_0: Part #: 101433-0001R

## Sheet SH04 - OMAP-L137 SERIAL.SchDoc
size 386 x 246 mm
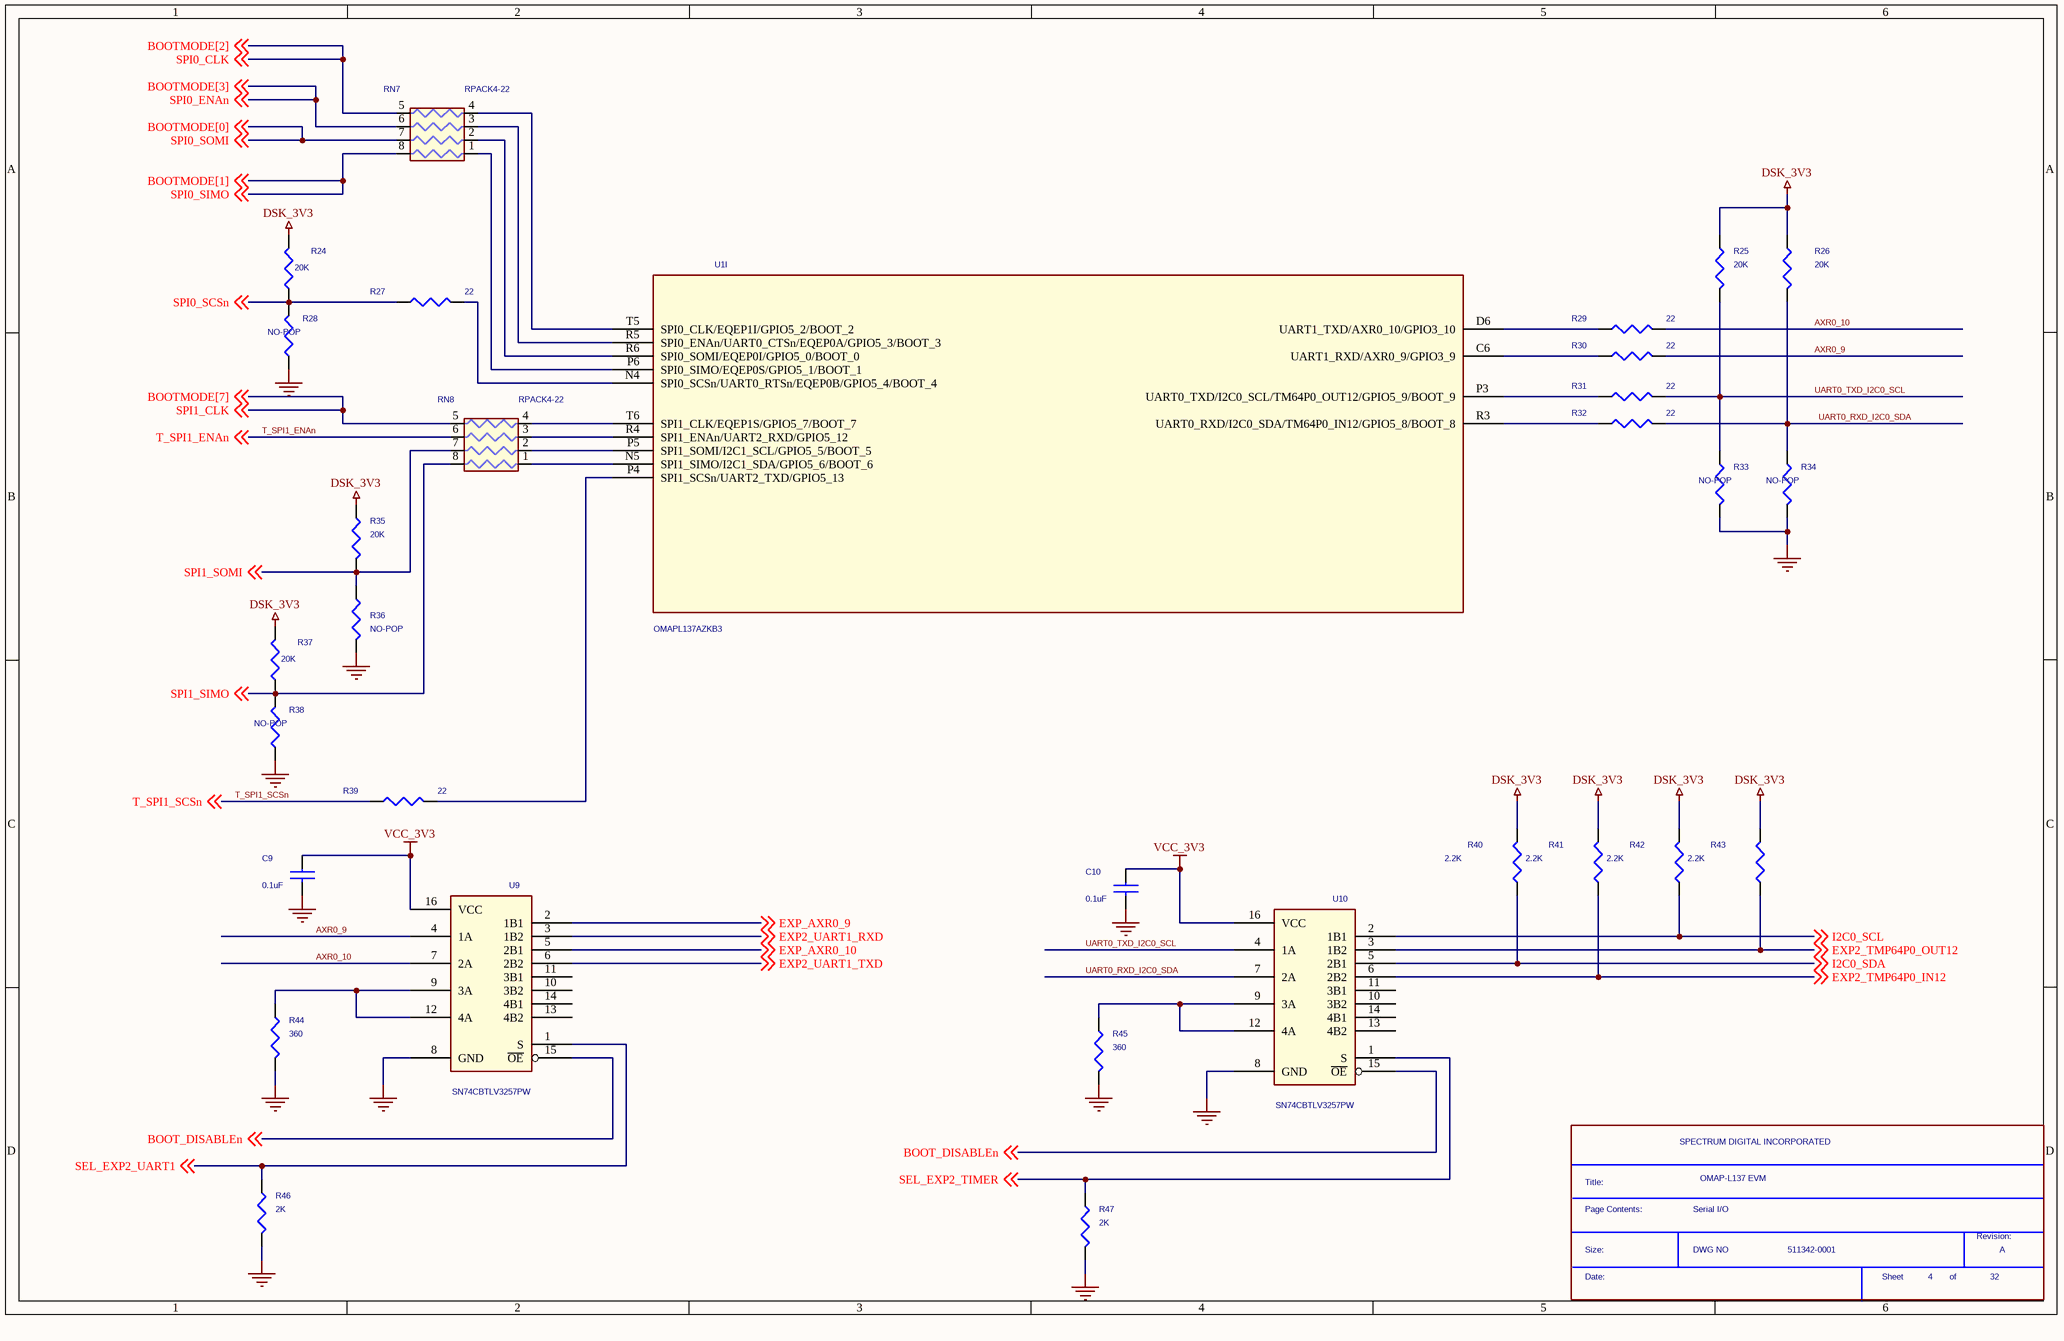
[diagram p28: SH04 - OMAP-L137 SERIAL.SchDoc]

### Parts
(Parts that share a designator on the sheet are numbered #1, #2 ... from top to bottom, then left to right.)
*#29  Page Contents:: Serial I/O  RevCode: A  Title: OMAP-L137 EVM  OrgName: SPECTRUM DIGITAL INCORPORATED  Doc: 511342-0001  Page Number: 4  Page Count: 32  (hidden comment: SDTitleBlock)  (graphical)
C9  0.1uF  [c402-25]
C10  0.1uF  [c402-25]
R24  20K  [r402-25]
R25  20K  [r402-25]
R26  20K  [r402-25]
R27  22  [r402-25]
R28  NO-POP  [r402-25]
R29  22  [r402-25]
R30  22  [r402-25]
R31  22  [r402-25]
R32  22  [r402-25]
R33  NO-POP  [r402-25]
R34  NO-POP  [r402-25]
R35  20K  [r402-25]
R36  NO-POP  [r402-25]
R37  20K  [r402-25]
R38  NO-POP  [r402-25]
R39  22  [r402-25]
R40  2.2K  [r402-25]
R41  2.2K  [r402-25]
R42  2.2K  [r402-25]
R43  2.2K  [r402-25]
R44  360  [r402-25]
R45  360  [r402-25]
R46  2K  [r402-25]
R47  2K  [r402-25]
RN7  RPACK4-22  [rpak8-10x25-28v]
RN8  RPACK4-22  [rpak8-10x25-28v]
U1  OMAPL137AZKB3  [skt256-6064]  (part I of 9)
U9  SN74CBTLV3257PW  [TSSOP-16]
U10  SN74CBTLV3257PW  [TSSOP-16]

### Nets
DSK_3V3: R24.1 R25.1 R26.1 R35.1 R37.1 R40.1 R41.1 R42.1 R43.1
GND: C9.2 C10.2 R28.2 R33.1 R34.1 R36.2 R38.2 R44.2 R45.2 R46.2 R47.2 U9.8(GND) U10.8(GND)
VCC_3V3: C9.1 C10.1 U9.16(VCC) U10.16(VCC)
AXR0_9: R30.2 U9.4(1A)
AXR0_10: R29.2 U9.7(2A)
BOOT_DISABLEn: U9.15(~{OE}) U10.15(~{OE}) ; off-sheet BOOT_DISABLEn
BOOTMODE[0]: RN7.7(R2B) ; off-sheet BOOTMODE[0], off-sheet SPI0_SOMI  [also labelled SPI0_SOMI]
BOOTMODE[1]: RN7.8(R1B) ; off-sheet SPI0_SIMO, off-sheet BOOTMODE[1]  [also labelled SPI0_SIMO]
BOOTMODE[2]: RN7.5(R4B) ; off-sheet SPI0_CLK, off-sheet BOOTMODE[2]  [also labelled SPI0_CLK]
BOOTMODE[3]: RN7.6(R3B) ; off-sheet BOOTMODE[3], off-sheet SPI0_ENAn  [also labelled SPI0_ENAn]
BOOTMODE[7]: RN8.5(R4B) ; off-sheet SPI1_CLK, off-sheet BOOTMODE[7]  [also labelled SPI1_CLK]
EXP2_TMP64P0_IN12: R41.2 U10.6(2B2) ; off-sheet EXP2_TMP64P0_IN12
EXP2_TMP64P0_OUT12: R43.2 U10.3(1B2) ; off-sheet EXP2_TMP64P0_OUT12
EXP2_UART1_RXD: U9.3(1B2) ; off-sheet EXP2_UART1_RXD
EXP2_UART1_TXD: U9.6(2B2) ; off-sheet EXP2_UART1_TXD
EXP_AXR0_9: U9.2(1B1) ; off-sheet EXP_AXR0_9
EXP_AXR0_10: U9.5(2B1) ; off-sheet EXP_AXR0_10
I2C0_SCL: R42.2 U10.2(1B1) ; off-sheet I2C0_SCL
I2C0_SDA: R40.2 U10.5(2B1) ; off-sheet I2C0_SDA
SEL_EXP2_TIMER: R47.1 U10.1(S) ; off-sheet SEL_EXP2_TIMER
SEL_EXP2_UART1: R46.1 U9.1(S) ; off-sheet SEL_EXP2_UART1
SPI0_SCSn: R24.2 R27.1 R28.1 ; off-sheet SPI0_SCSn
SPI1_SIMO: R37.2 R38.1 RN8.8(R1B) ; off-sheet SPI1_SIMO
SPI1_SOMI: R35.2 R36.1 RN8.7(R2B) ; off-sheet SPI1_SOMI
T_SPI1_ENAn: RN8.6(R3B) ; off-sheet T_SPI1_ENAn
T_SPI1_SCSn: R39.1 ; off-sheet T_SPI1_SCSn
UART0_RXD_I2C0_SDA: R26.2 R32.2 R34.2 U10.7(2A)
UART0_TXD_I2C0_SCL: R25.2 R31.2 R33.2 U10.4(1A)
NetR27_2: R27.2 U1.N4(SPI0_SCSn/UART0_RTSn/EQEP0B/GPIO5_4/BOOT_4)
NetR29_1: R29.1 U1.D6(UART1_TXD/AXR0_10/GPIO3_10)
NetR30_1: R30.1 U1.C6(UART1_RXD/AXR0_9/GPIO3_9)
NetR31_1: R31.1 U1.P3(UART0_TXD/I2C0_SCL/TM64P0_OUT12/GPIO5_9/BOOT_9)
NetR32_1: R32.1 U1.R3(UART0_RXD/I2C0_SDA/TM64P0_IN12/GPIO5_8/BOOT_8)
NetR39_2: R39.2 U1.P4(SPI1_SCSn/UART2_TXD/GPIO5_13)
NetR44_1: R44.1 U9.9(3A) U9.12(4A)
NetR45_1: R45.1 U10.9(3A) U10.12(4A)
NetRN7_1: RN7.1(R1A) U1.P6(SPI0_SIMO/EQEP0S/GPIO5_1/BOOT_1)
NetRN7_2: RN7.2(R2A) U1.R6(SPI0_SOMI/EQEP0I/GPIO5_0/BOOT_0)
NetRN7_3: RN7.3(R3A) U1.R5(SPI0_ENAn/UART0_CTSn/EQEP0A/GPIO5_3/BOOT_3)
NetRN7_4: RN7.4(R4A) U1.T5(SPI0_CLK/EQEP1I/GPIO5_2/BOOT_2)
NetRN8_1: RN8.1(R1A) U1.N5(SPI1_SIMO/I2C1_SDA/GPIO5_6/BOOT_6)
NetRN8_2: RN8.2(R2A) U1.P5(SPI1_SOMI/I2C1_SCL/GPIO5_5/BOOT_5)
NetRN8_3: RN8.3(R3A) U1.R4(SPI1_ENAn/UART2_RXD/GPIO5_12)
NetRN8_4: RN8.4(R4A) U1.T6(SPI1_CLK/EQEP1S/GPIO5_7/BOOT_7)

Not connected (* = marked no-connect by the designer): U9 10(3B2) 11(3B1) 13(4B2) 14(4B1); U10 10(3B2) 11(3B1) 13(4B2) 14(4B1)

### Notes on the sheet
- (in symbol SDTitleBlock) Title:; Page Contents:; Revision:; Size:; DWG NO; Date:; Sheet; of

### Library data of the parts
C9 C10 = CAP NP: Part #: 101587-1100R
R24-R26 R35 R37 = R_1: Part #: 101370-2003R
R27 R29-R32 R39 = R_1: Part #: 101370-2200R
R28 R33 R34 R36 R38 = R_1: Part #: R0402-NOPOP
R40-R43 = R: Part #: 101370-2202R
R44 R45 = R: Part #: 101370-3601R
R46 R47 = R: Part #: 101370-2002R
RN7 RN8 = R-Pak4_0: Part #: 101327-2200R
U1 = PRIMUS_BGA_1: as U1 on sheet SH08 - OMAP-L137 EMIF A
U9 U10 = SN74CBT3257PW: as U16 on sheet SH08 - OMAP-L137 EMIF A

## Sheet SH03 - ETHERNET MUXES.SchDoc
size 386 x 246 mm
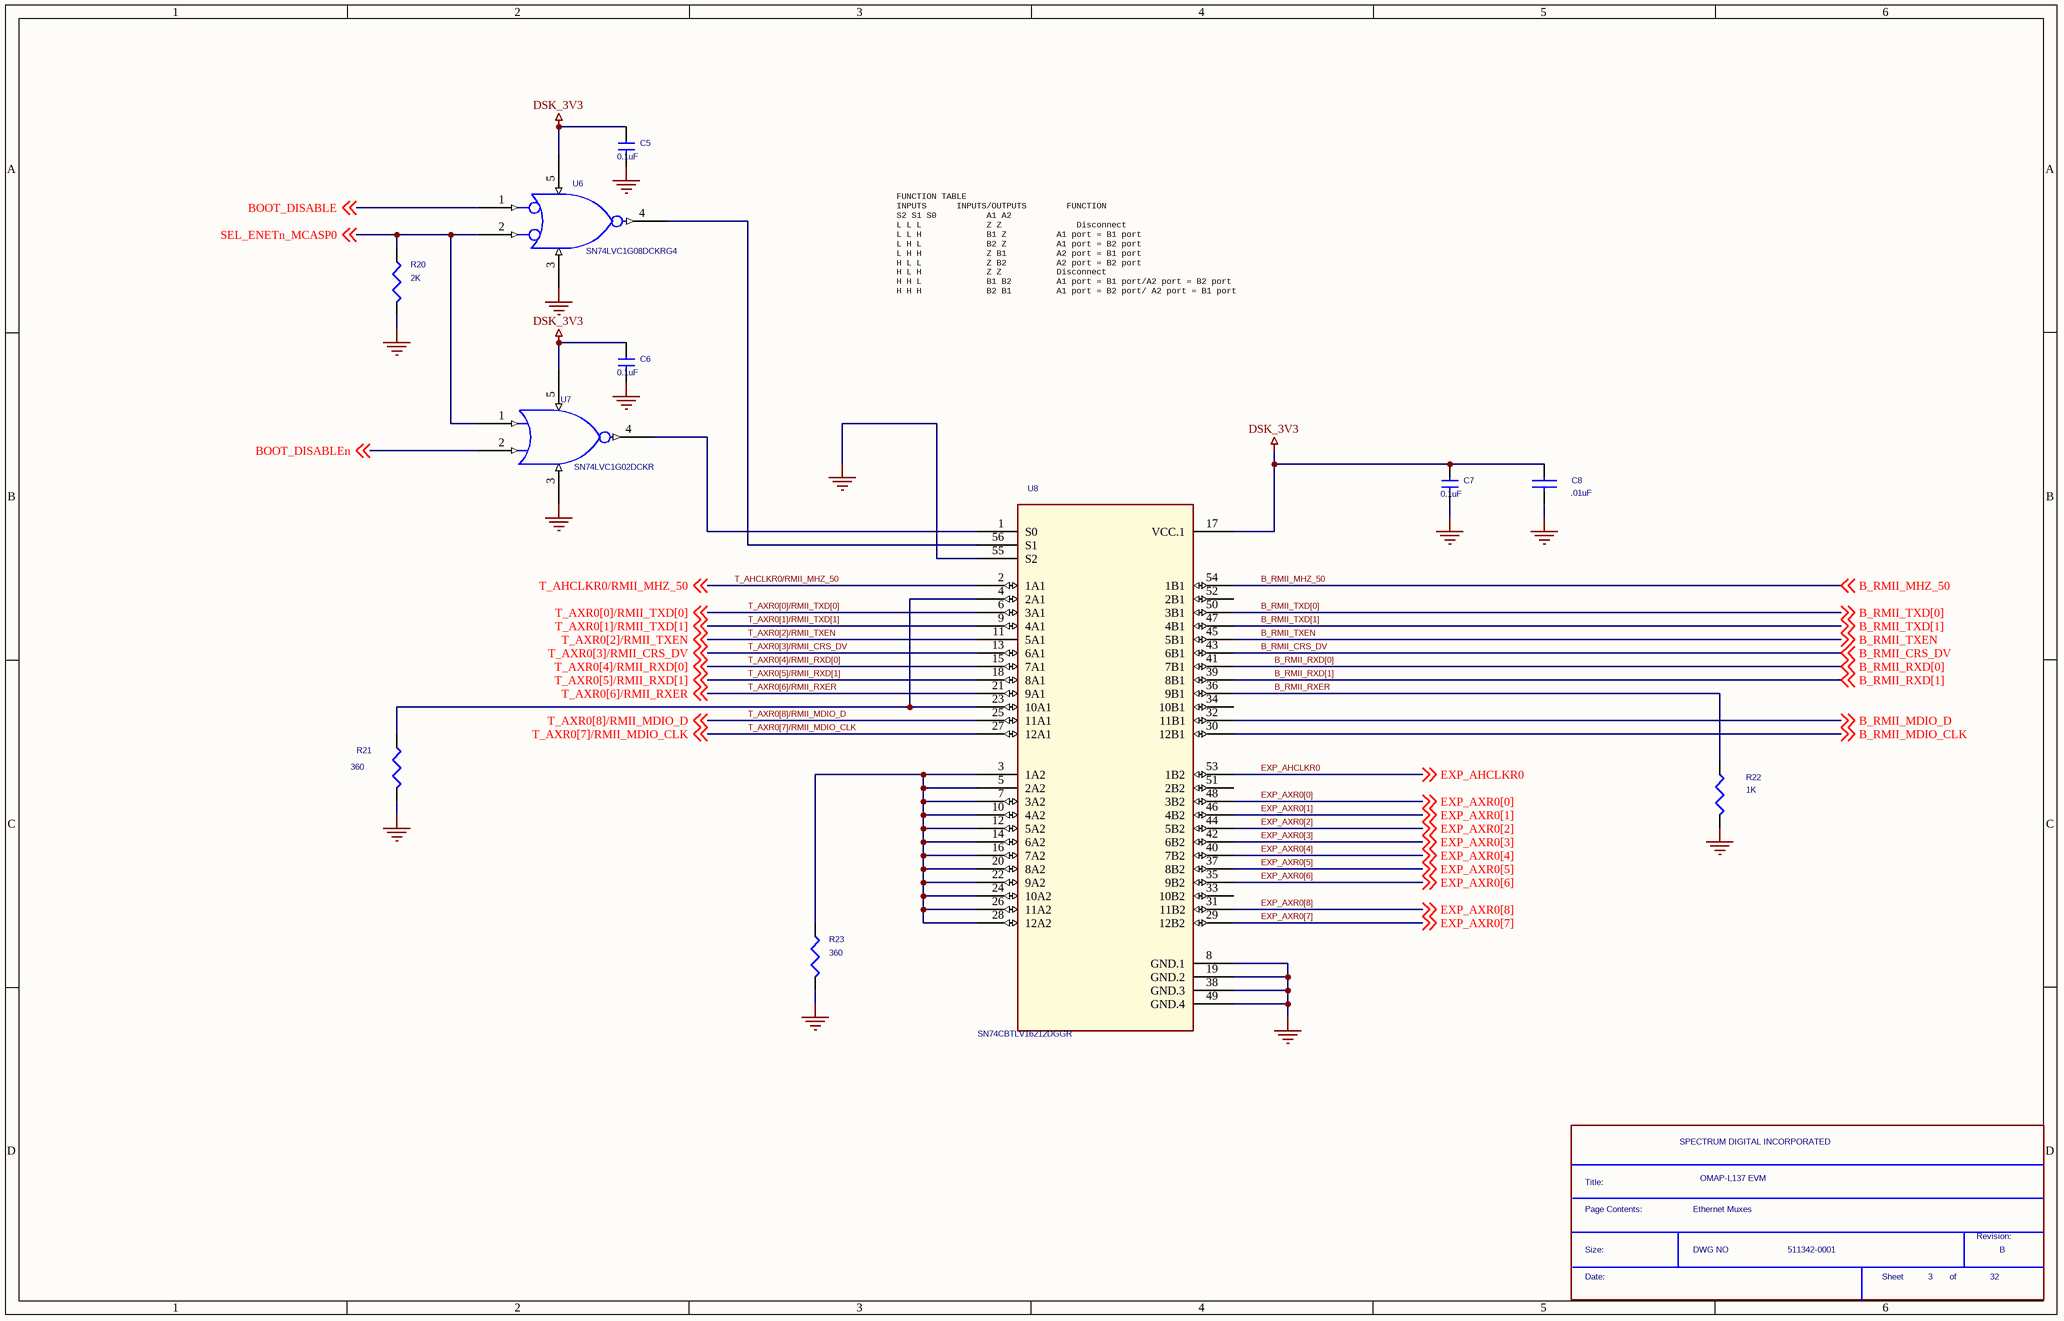
[diagram p29: SH03 - ETHERNET MUXES.SchDoc]

### Parts
(Parts that share a designator on the sheet are numbered #1, #2 ... from top to bottom, then left to right.)
*#30  Page Contents:: Ethernet Muxes  RevCode: B  Title: OMAP-L137 EVM  OrgName: SPECTRUM DIGITAL INCORPORATED  Doc: 511342-0001  Page Number: 3  Page Count: 32  (hidden comment: SDTitleBlock)  (graphical)
C5  0.1uF  [c402-25]
C6  0.1uF  [c402-25]
C7  0.1uF  [c402-25]
C8  .01uF  [c402-25]
R20  2K  [r402-25]
R21  360  [r402-25]
R22  1K  [r402-25]
R23  360  [r402-25]
U6  SN74LVC1G08DCKRG4  [SO5]
U7  SN74LVC1G02DCKR  [dck-5]
U8  SN74CBTLV16212DGGR  [56 pin TSSOP]

### Nets
DSK_3V3: C5.1 C6.1 C7.1 C8.1 U6.5(VCC) U7.5(VCC) U8.17(VCC.1)
GND: C5.2 C6.2 C7.2 C8.2 R20.2 R21.1 R22.2 R23.2 U6.3(GND) U7.3(GND) U8.8(GND.1) U8.19(GND.2) U8.38(GND.3) U8.49(GND.4) U8.55(S2)
B_RMII_CRS_DV: U8.43(6B1) ; off-sheet B_RMII_CRS_DV
B_RMII_MDIO_CLK: U8.30(12B1) ; off-sheet B_RMII_MDIO_CLK
B_RMII_MDIO_D: U8.32(11B1) ; off-sheet B_RMII_MDIO_D
B_RMII_MHZ_50: U8.54(1B1) ; off-sheet B_RMII_MHZ_50
B_RMII_RXD[0]: U8.41(7B1) ; off-sheet B_RMII_RXD[0]
B_RMII_RXD[1]: U8.39(8B1) ; off-sheet B_RMII_RXD[1]
B_RMII_RXER: R22.1 U8.36(9B1)
B_RMII_TXD[0]: U8.50(3B1) ; off-sheet B_RMII_TXD[0]
B_RMII_TXD[1]: U8.47(4B1) ; off-sheet B_RMII_TXD[1]
B_RMII_TXEN: U8.45(5B1) ; off-sheet B_RMII_TXEN
BOOT_DISABLE: U6.1(B) ; off-sheet BOOT_DISABLE
BOOT_DISABLEn: U7.2(A) ; off-sheet BOOT_DISABLEn
EXP_AHCLKR0: U8.53(1B2) ; off-sheet EXP_AHCLKR0
EXP_AXR0[0]: U8.48(3B2) ; off-sheet EXP_AXR0[0]
EXP_AXR0[1]: U8.46(4B2) ; off-sheet EXP_AXR0[1]
EXP_AXR0[2]: U8.44(5B2) ; off-sheet EXP_AXR0[2]
EXP_AXR0[3]: U8.42(6B2) ; off-sheet EXP_AXR0[3]
EXP_AXR0[4]: U8.40(7B2) ; off-sheet EXP_AXR0[4]
EXP_AXR0[5]: U8.37(8B2) ; off-sheet EXP_AXR0[5]
EXP_AXR0[6]: U8.35(9B2) ; off-sheet EXP_AXR0[6]
EXP_AXR0[7]: U8.29(12B2) ; off-sheet EXP_AXR0[7]
EXP_AXR0[8]: U8.31(11B2) ; off-sheet EXP_AXR0[8]
SEL_ENETn_MCASP0: R20.1 U6.2(A) U7.1(B) ; off-sheet SEL_ENETn_MCASP0
T_AHCLKR0/RMII_MHZ_50: U8.2(1A1) ; off-sheet T_AHCLKR0/RMII_MHZ_50
T_AXR0[0]/RMII_TXD[0]: U8.6(3A1) ; off-sheet T_AXR0[0]/RMII_TXD[0]
T_AXR0[1]/RMII_TXD[1]: U8.9(4A1) ; off-sheet T_AXR0[1]/RMII_TXD[1]
T_AXR0[2]/RMII_TXEN: U8.11(5A1) ; off-sheet T_AXR0[2]/RMII_TXEN
T_AXR0[3]/RMII_CRS_DV: U8.13(6A1) ; off-sheet T_AXR0[3]/RMII_CRS_DV
T_AXR0[4]/RMII_RXD[0]: U8.15(7A1) ; off-sheet T_AXR0[4]/RMII_RXD[0]
T_AXR0[5]/RMII_RXD[1]: U8.18(8A1) ; off-sheet T_AXR0[5]/RMII_RXD[1]
T_AXR0[6]/RMII_RXER: U8.21(9A1) ; off-sheet T_AXR0[6]/RMII_RXER
T_AXR0[7]/RMII_MDIO_CLK: U8.27(12A1) ; off-sheet T_AXR0[7]/RMII_MDIO_CLK
T_AXR0[8]/RMII_MDIO_D: U8.25(11A1) ; off-sheet T_AXR0[8]/RMII_MDIO_D
NetR21_2: R21.2 U8.4(2A1) U8.23(10A1)
NetR23_1: R23.1 U8.3(1A2) U8.5(2A2) U8.7(3A2) U8.10(4A2) U8.12(5A2) U8.14(6A2) U8.16(7A2) U8.20(8A2) U8.22(9A2) U8.24(10A2) U8.26(11A2) U8.28(12A2)
NetU6_4: U6.4(Y) U8.56(S1)
NetU7_4: U7.4(Y) U8.1(S0)

Not connected (* = marked no-connect by the designer): U8 33(10B2) 34(10B1) 51(2B2) 52(2B1)

### Notes on the sheet
- FUNCTION TABLE
  INPUTS      INPUTS/OUTPUTS        FUNCTION
  S2 S1 S0          A1 A2
  L L L             Z Z               Disconnect
  L L H             B1 Z          A1 port = B1 port
  L H L             B2 Z          A1 port = B2 port
  L H H             Z B1          A2 port = B1 port
  H L L             Z B2          A2 port = B2 port
  H L H             Z Z           Disconnect
  H H L             B1 B2         A1 port = B1 port/A2 port = B2 port
  H H H             B2 B1         A1 port = B2 port/ A2 port = B1 port
- (in symbol SDTitleBlock) Title:; Page Contents:; Revision:; Size:; DWG NO; Date:; Sheet; of

### Library data of the parts
C5-C7 = CAP NP_1: Part #: 101587-1100R
C8 = CAP NP_0: Part #: 101587-1101R
R20 = R: Part #: 101370-2002R
R21 R23 = R: Part #: 101370-3601R
R22 = R_0: Part #: 101370-1002R
U6 = 1G08: Part #: 101057-0008R
U7 = 1g02_0: Part #: 101057-0002R
U8 = SN74CBT16212DGGR: Part #: 102693-0001R; SD PCB Footprint: TSSOP56

## Sheet SH02 - OMAP-L137 MCASP.SchDoc
size 386 x 246 mm
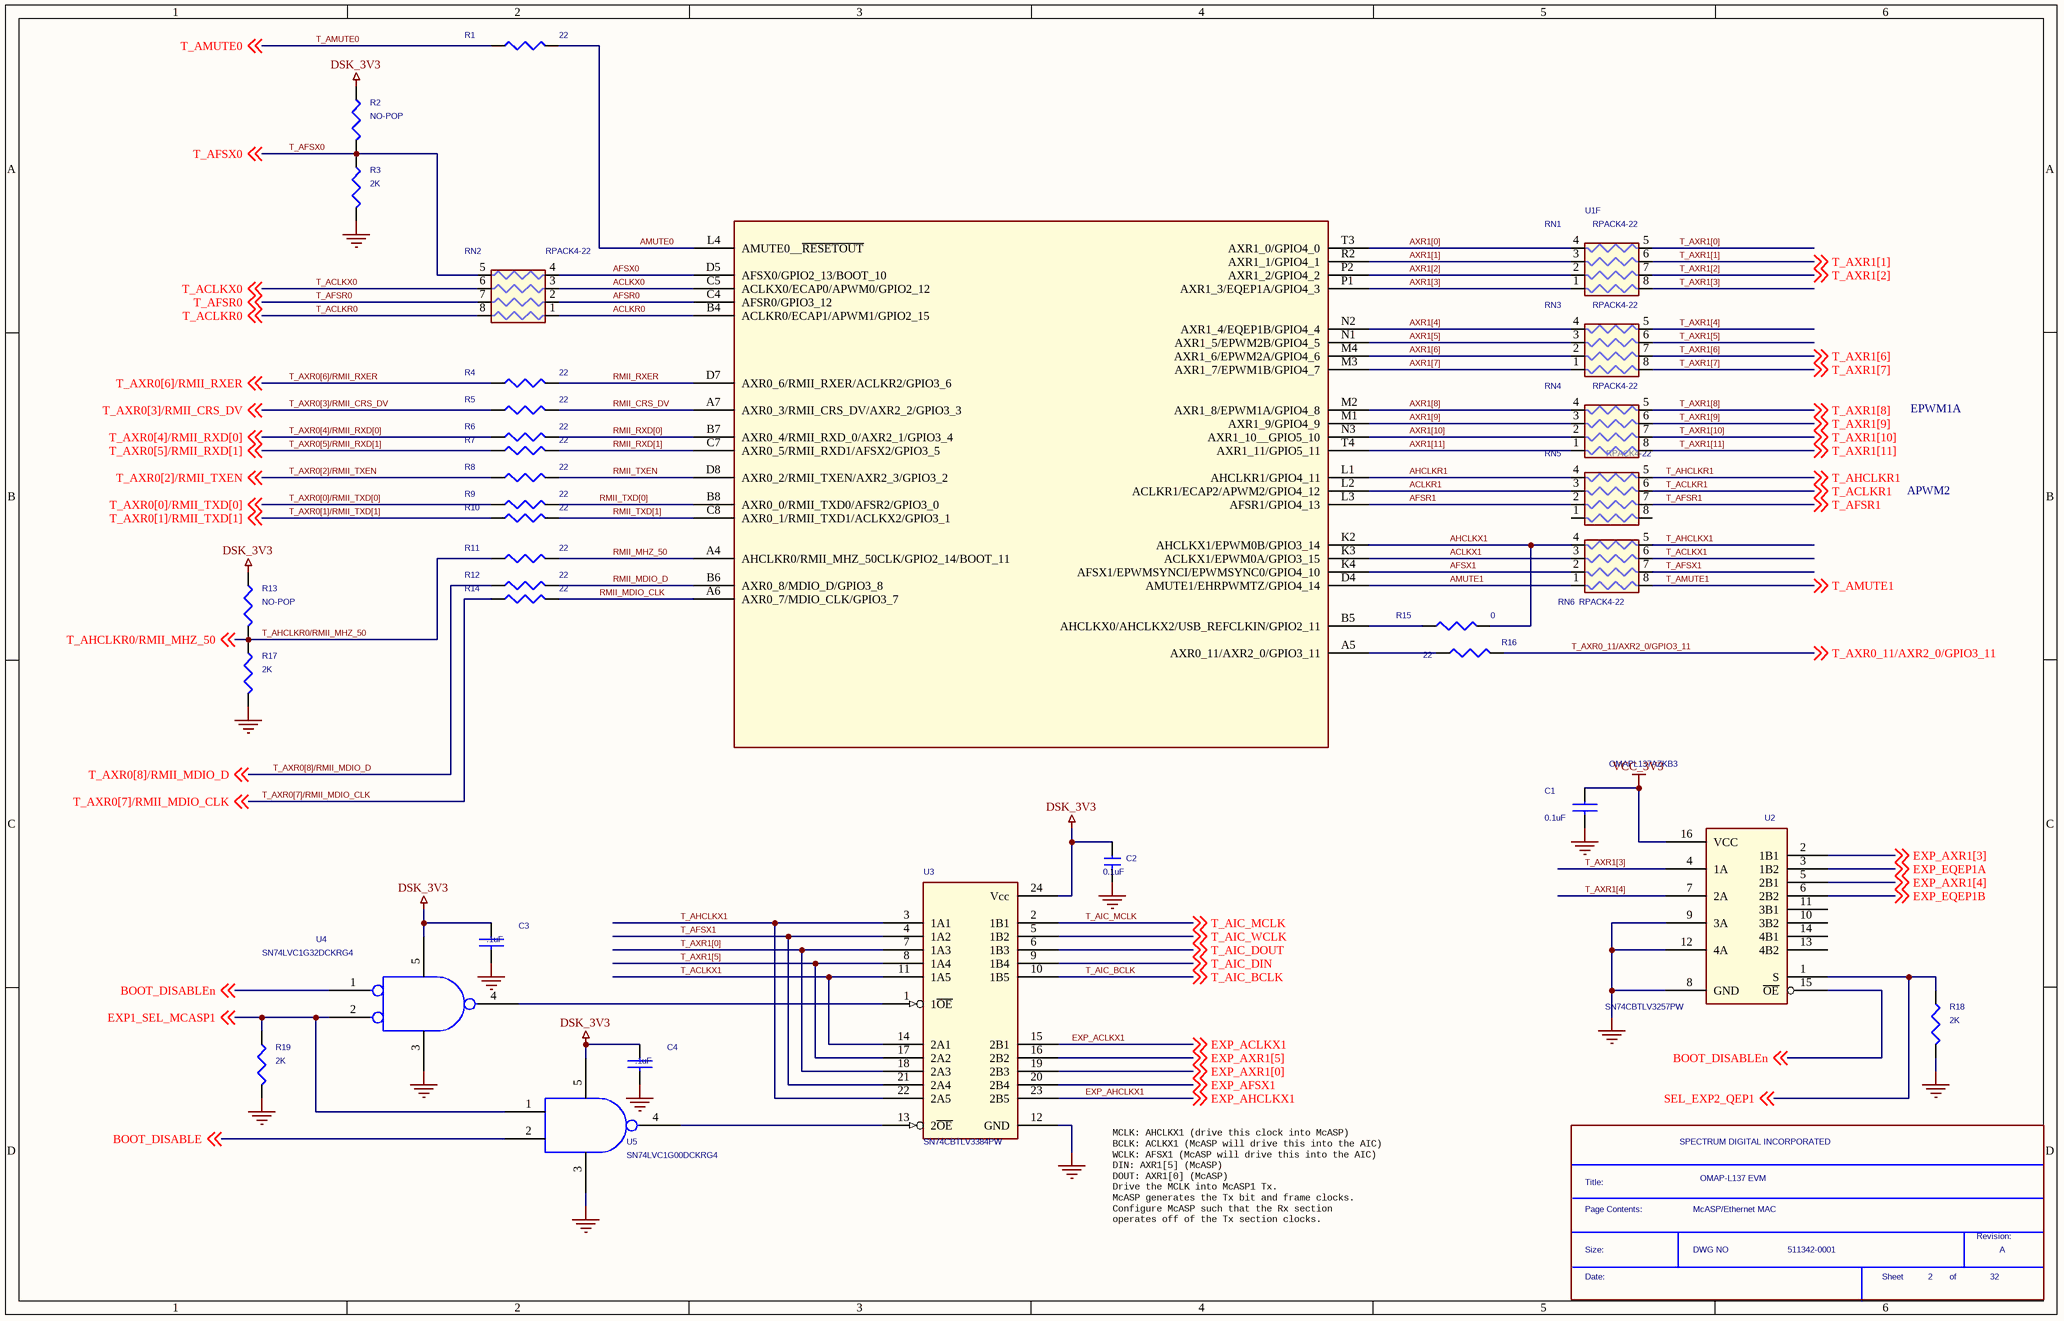
[diagram p30: SH02 - OMAP-L137 MCASP.SchDoc]

### Parts
(Parts that share a designator on the sheet are numbered #1, #2 ... from top to bottom, then left to right.)
*#31  Page Contents:: McASP/Ethernet MAC  RevCode: A  Title: OMAP-L137 EVM  OrgName: SPECTRUM DIGITAL INCORPORATED  Doc: 511342-0001  Page Number: 2  Page Count: 32  (hidden comment: SDTitleBlock)  (graphical)
C1  0.1uF  [c402-25]
C2  0.1uF  [c402-25]
C3  .1uF  [c402-25]
C4  .1uF  [c402-25]
R1  22  [r402-25]
R2  NO-POP  [r402-25]
R3  2K  [r402-25]
R4  22  [r402-25]
R5  22  [r402-25]
R6  22  [r402-25]
R7  22  [r402-25]
R8  22  [r402-25]
R9  22  [r402-25]
R10  22  [r402-25]
R11  22  [r402-25]
R12  22  [r402-25]
R13  NO-POP  [r402-25]
R14  22  [r402-25]
R15  0  [r402-25]
R16  22  [r402-25]
R17  2K  [r402-25]
R18  2K  [r402-25]
R19  2K  [r402-25]
RN1  RPACK4-22  [rpak8-10x25-28v]
RN2  RPACK4-22  [rpak8-10x25-28v]
RN3  RPACK4-22  [rpak8-10x25-28v]
RN4  RPACK4-22  [rpak8-10x25-28v]
RN5  RPACK4-22  [rpak8-10x25-28v]
RN6  RPACK4-22  [rpak8-10x25-28v]
U1  OMAPL137AZKB3  [skt256-6064]  (part F of 9)
U2  SN74CBTLV3257PW  [TSSOP-16]
U3  SN74CBTLV3384PW  [TSSOP-24]
U4  SN74LVC1G32DCKRG4  [dck-5]
U5  SN74LVC1G00DCKRG4  [dck-5]

### Nets
DSK_3V3: C2.1 C3.1 C4.1 R2.1 R13.1 U3.24(Vcc) U4.5(VCC) U5.5(VCC)
GND: C1.2 C2.2 C3.2 C4.2 R3.2 R17.2 R18.2 R19.2 U2.8(GND) U2.9(3A) U2.12(4A) U3.12(GND) U4.3(GND) U5.3(GND)
VCC_3V3: C1.1 U2.16(VCC)
ACLKR0: RN2.1(R1A) U1.B4(ACLKR0/ECAP1/APWM1/GPIO2_15)
ACLKR1: RN5.3(R3A) U1.L2(ACLKR1/ECAP2/APWM2/GPIO4_12)
ACLKX0: RN2.3(R3A) U1.C5(ACLKX0/ECAP0/APWM0/GPIO2_12)
ACLKX1: RN6.3(R3A) U1.K3(ACLKX1/EPWM0A/GPIO3_15)
AFSR0: RN2.2(R2A) U1.C4(AFSR0/GPIO3_12)
AFSR1: RN5.2(R2A) U1.L3(AFSR1/GPIO4_13)
AFSX0: RN2.4(R4A) U1.D5(AFSX0/GPIO2_13/BOOT_10)
AFSX1: RN6.2(R2A) U1.K4(AFSX1/EPWMSYNCI/EPWMSYNC0/GPIO4_10)
AHCLKR1: RN5.4(R4A) U1.L1(AHCLKR1/GPIO4_11)
AHCLKX1: R15.2 RN6.4(R4A) U1.K2(AHCLKX1/EPWM0B/GPIO3_14)
AMUTE0: R1.2 U1.L4(AMUTE0__~{RESETOUT})
AMUTE1: RN6.1(R1A) U1.D4(AMUTE1/EHRPWMTZ/GPIO4_14)
AXR1[0]: RN1.4(R4A) U1.T3(AXR1_0/GPIO4_0)
AXR1[1]: RN1.3(R3A) U1.R2(AXR1_1/GPIO4_1)
AXR1[2]: RN1.2(R2A) U1.P2(AXR1_2/GPIO4_2)
AXR1[3]: RN1.1(R1A) U1.P1(AXR1_3/EQEP1A/GPIO4_3)
AXR1[4]: RN3.4(R4A) U1.N2(AXR1_4/EQEP1B/GPIO4_4)
AXR1[5]: RN3.3(R3A) U1.N1(AXR1_5/EPWM2B/GPIO4_5)
AXR1[6]: RN3.2(R2A) U1.M4(AXR1_6/EPWM2A/GPIO4_6)
AXR1[7]: RN3.1(R1A) U1.M3(AXR1_7/EPWM1B/GPIO4_7)
AXR1[8]: RN4.4(R4A) U1.M2(AXR1_8/EPWM1A/GPIO4_8)
AXR1[9]: RN4.3(R3A) U1.M1(AXR1_9/GPIO4_9)
AXR1[10]: RN4.2(R2A) U1.N3(AXR1_10__GPIO5_10)
AXR1[11]: RN4.1(R1A) U1.T4(AXR1_11/GPIO5_11)
BOOT_DISABLE: U5.2(B) ; off-sheet BOOT_DISABLE
BOOT_DISABLEn: U2.15(~{OE}) U4.1(A) ; off-sheet BOOT_DISABLEn
EXP1_SEL_MCASP1: R19.1 U4.2(B) U5.1(A) ; off-sheet EXP1_SEL_MCASP1
EXP_ACLKX1: U3.15(2B1) ; off-sheet EXP_ACLKX1
EXP_AFSX1: U3.20(2B4) ; off-sheet EXP_AFSX1
EXP_AHCLKX1: U3.23(2B5) ; off-sheet EXP_AHCLKX1
EXP_AXR1[0]: U3.19(2B3) ; off-sheet EXP_AXR1[0]
EXP_AXR1[3]: U2.2(1B1) ; off-sheet EXP_AXR1[3]
EXP_AXR1[4]: U2.5(2B1) ; off-sheet EXP_AXR1[4]
EXP_AXR1[5]: U3.16(2B2) ; off-sheet EXP_AXR1[5]
EXP_EQEP1A: U2.3(1B2) ; off-sheet EXP_EQEP1A
EXP_EQEP1B: U2.6(2B2) ; off-sheet EXP_EQEP1B
RMII_CRS_DV: R5.2 U1.A7(AXR0_3/RMII_CRS_DV/AXR2_2/GPIO3_3)
RMII_MDIO_CLK: R14.2 U1.A6(AXR0_7/MDIO_CLK/GPIO3_7)
RMII_MDIO_D: R12.2 U1.B6(AXR0_8/MDIO_D/GPIO3_8)
RMII_MHZ_50: R11.2 U1.A4(AHCLKR0/RMII_MHZ_50CLK/GPIO2_14/BOOT_11)
RMII_RXD[0]: R6.2 U1.B7(AXR0_4/RMII_RXD_0/AXR2_1/GPIO3_4)
RMII_RXD[1]: R7.2 U1.C7(AXR0_5/RMII_RXD1/AFSX2/GPIO3_5)
RMII_RXER: R4.2 U1.D7(AXR0_6/RMII_RXER/ACLKR2/GPIO3_6)
RMII_TXD[0]: R9.2 U1.B8(AXR0_0/RMII_TXD0/AFSR2/GPIO3_0)
RMII_TXD[1]: R10.2 U1.C8(AXR0_1/RMII_TXD1/ACLKX2/GPIO3_1)
RMII_TXEN: R8.2 U1.D8(AXR0_2/RMII_TXEN/AXR2_3/GPIO3_2)
SEL_EXP2_QEP1: R18.1 U2.1(S) ; off-sheet SEL_EXP2_QEP1
T_ACLKR0: RN2.8(R1B) ; off-sheet T_ACLKR0
T_ACLKR1: RN5.6(R3B) ; off-sheet T_ACLKR1
T_ACLKX0: RN2.6(R3B) ; off-sheet T_ACLKX0
T_ACLKX1: RN6.6(R3B) U3.11(1A5) U3.14(2A1)
T_AFSR0: RN2.7(R2B) ; off-sheet T_AFSR0
T_AFSR1: RN5.7(R2B) ; off-sheet T_AFSR1
T_AFSX0: R2.2 R3.1 RN2.5(R4B) ; off-sheet T_AFSX0
T_AFSX1: RN6.7(R2B) U3.4(1A2) U3.21(2A4)
T_AHCLKR0/RMII_MHZ_50: R11.1 R13.2 R17.1 ; off-sheet T_AHCLKR0/RMII_MHZ_50
T_AHCLKR1: RN5.5(R4B) ; off-sheet T_AHCLKR1
T_AHCLKX1: RN6.5(R4B) U3.3(1A1) U3.22(2A5)
T_AIC_BCLK: U3.10(1B5) ; off-sheet T_AIC_BCLK
T_AIC_DIN: U3.9(1B4) ; off-sheet T_AIC_DIN
T_AIC_DOUT: U3.6(1B3) ; off-sheet T_AIC_DOUT
T_AIC_MCLK: U3.2(1B1) ; off-sheet T_AIC_MCLK
T_AIC_WCLK: U3.5(1B2) ; off-sheet T_AIC_WCLK
T_AMUTE0: R1.1 ; off-sheet T_AMUTE0
T_AMUTE1: RN6.8(R1B) ; off-sheet T_AMUTE1
T_AXR0[0]/RMII_TXD[0]: R9.1 ; off-sheet T_AXR0[0]/RMII_TXD[0]
T_AXR0[1]/RMII_TXD[1]: R10.1 ; off-sheet T_AXR0[1]/RMII_TXD[1]
T_AXR0[2]/RMII_TXEN: R8.1 ; off-sheet T_AXR0[2]/RMII_TXEN
T_AXR0[3]/RMII_CRS_DV: R5.1 ; off-sheet T_AXR0[3]/RMII_CRS_DV
T_AXR0[4]/RMII_RXD[0]: R6.1 ; off-sheet T_AXR0[4]/RMII_RXD[0]
T_AXR0[5]/RMII_RXD[1]: R7.1 ; off-sheet T_AXR0[5]/RMII_RXD[1]
T_AXR0[6]/RMII_RXER: R4.1 ; off-sheet T_AXR0[6]/RMII_RXER
T_AXR0[7]/RMII_MDIO_CLK: R14.1 ; off-sheet T_AXR0[7]/RMII_MDIO_CLK
T_AXR0[8]/RMII_MDIO_D: R12.1 ; off-sheet T_AXR0[8]/RMII_MDIO_D
T_AXR0_11/AXR2_0/GPIO3_11: R16.1 ; off-sheet T_AXR0_11/AXR2_0/GPIO3_11
T_AXR1[0]: RN1.5(R4B) U3.7(1A3) U3.18(2A3)
T_AXR1[1]: RN1.6(R3B) ; off-sheet T_AXR1[1]
T_AXR1[2]: RN1.7(R2B) ; off-sheet T_AXR1[2]
T_AXR1[3]: RN1.8(R1B) U2.4(1A)
T_AXR1[4]: RN3.5(R4B) U2.7(2A)
T_AXR1[5]: RN3.6(R3B) U3.8(1A4) U3.17(2A2)
T_AXR1[6]: RN3.7(R2B) ; off-sheet T_AXR1[6]
T_AXR1[7]: RN3.8(R1B) ; off-sheet T_AXR1[7]
T_AXR1[8]: RN4.5(R4B) ; off-sheet T_AXR1[8]
T_AXR1[9]: RN4.6(R3B) ; off-sheet T_AXR1[9]
T_AXR1[10]: RN4.7(R2B) ; off-sheet T_AXR1[10]
T_AXR1[11]: RN4.8(R1B) ; off-sheet T_AXR1[11]
NetR15_1: R15.1 U1.B5(AHCLKX0/AHCLKX2/USB_REFCLKIN/GPIO2_11)
NetR16_2: R16.2 U1.A5(AXR0_11/AXR2_0/GPIO3_11)
NetU3_1: U3.1(1~{OE}) U4.4(Y)
NetU3_13: U3.13(2~{OE}) U5.4(Y)

Not connected (* = marked no-connect by the designer): RN5 1(R1A) 8(R1B); U2 10(3B2) 11(3B1) 13(4B2) 14(4B1)

### Notes on the sheet
- EPWM1A
- APWM2
- (near *#31) MCLK: AHCLKX1 (drive this clock into McASP)
  BCLK: ACLKX1 (McASP will drive this into the AIC)
  WCLK: AFSX1 (McASP will drive this into the AIC)
  DIN: AXR1[5] (McASP)
  DOUT: AXR1[0] (McASP)
  Drive the MCLK into McASP1 Tx.
  McASP generates the Tx bit and frame clocks.
  Configure McASP such that the Rx section
  operates off of the Tx section clocks.
- (in symbol SDTitleBlock) Title:; Page Contents:; Revision:; Size:; DWG NO; Date:; Sheet; of

### Library data of the parts
C1 = CAP NP: Part #: 101587-1100R
C2 = CAP NP_1: Part #: 101587-1100R
C3 C4 = CAP NP_2: Part #: 101587-1100R
R1 R4-R12 R14 R16 = R: Part #: 101370-2200R
R2 R13 = R_1: Part #: R0402-NOPOP
R3 R17 = R_1: Part #: 101370-2002R
R15 = R: Part #: 101370-0001R
R18 R19 = R: Part #: 101370-2002R
RN1-RN6 = R-Pak4_0: Part #: 101327-2200R
U1 = PRIMUS_BGA_1: as U1 on sheet SH08 - OMAP-L137 EMIF A
U2 = SN74CBT3257PW: as U16 on sheet SH08 - OMAP-L137 EMIF A
U3 = SN74CBTD3384PW: IC, Quad 2-to-1 Mux with Level Conversion; Part #: 101679-0001R; Mfg: TI
U4 = 1g32neg: Part #: 101057-0032R
U5 = 1g00_0: Part #: 101057-0001R

## Sheet SH01 - TITLE PAGE.SchDoc
size 386 x 246 mm
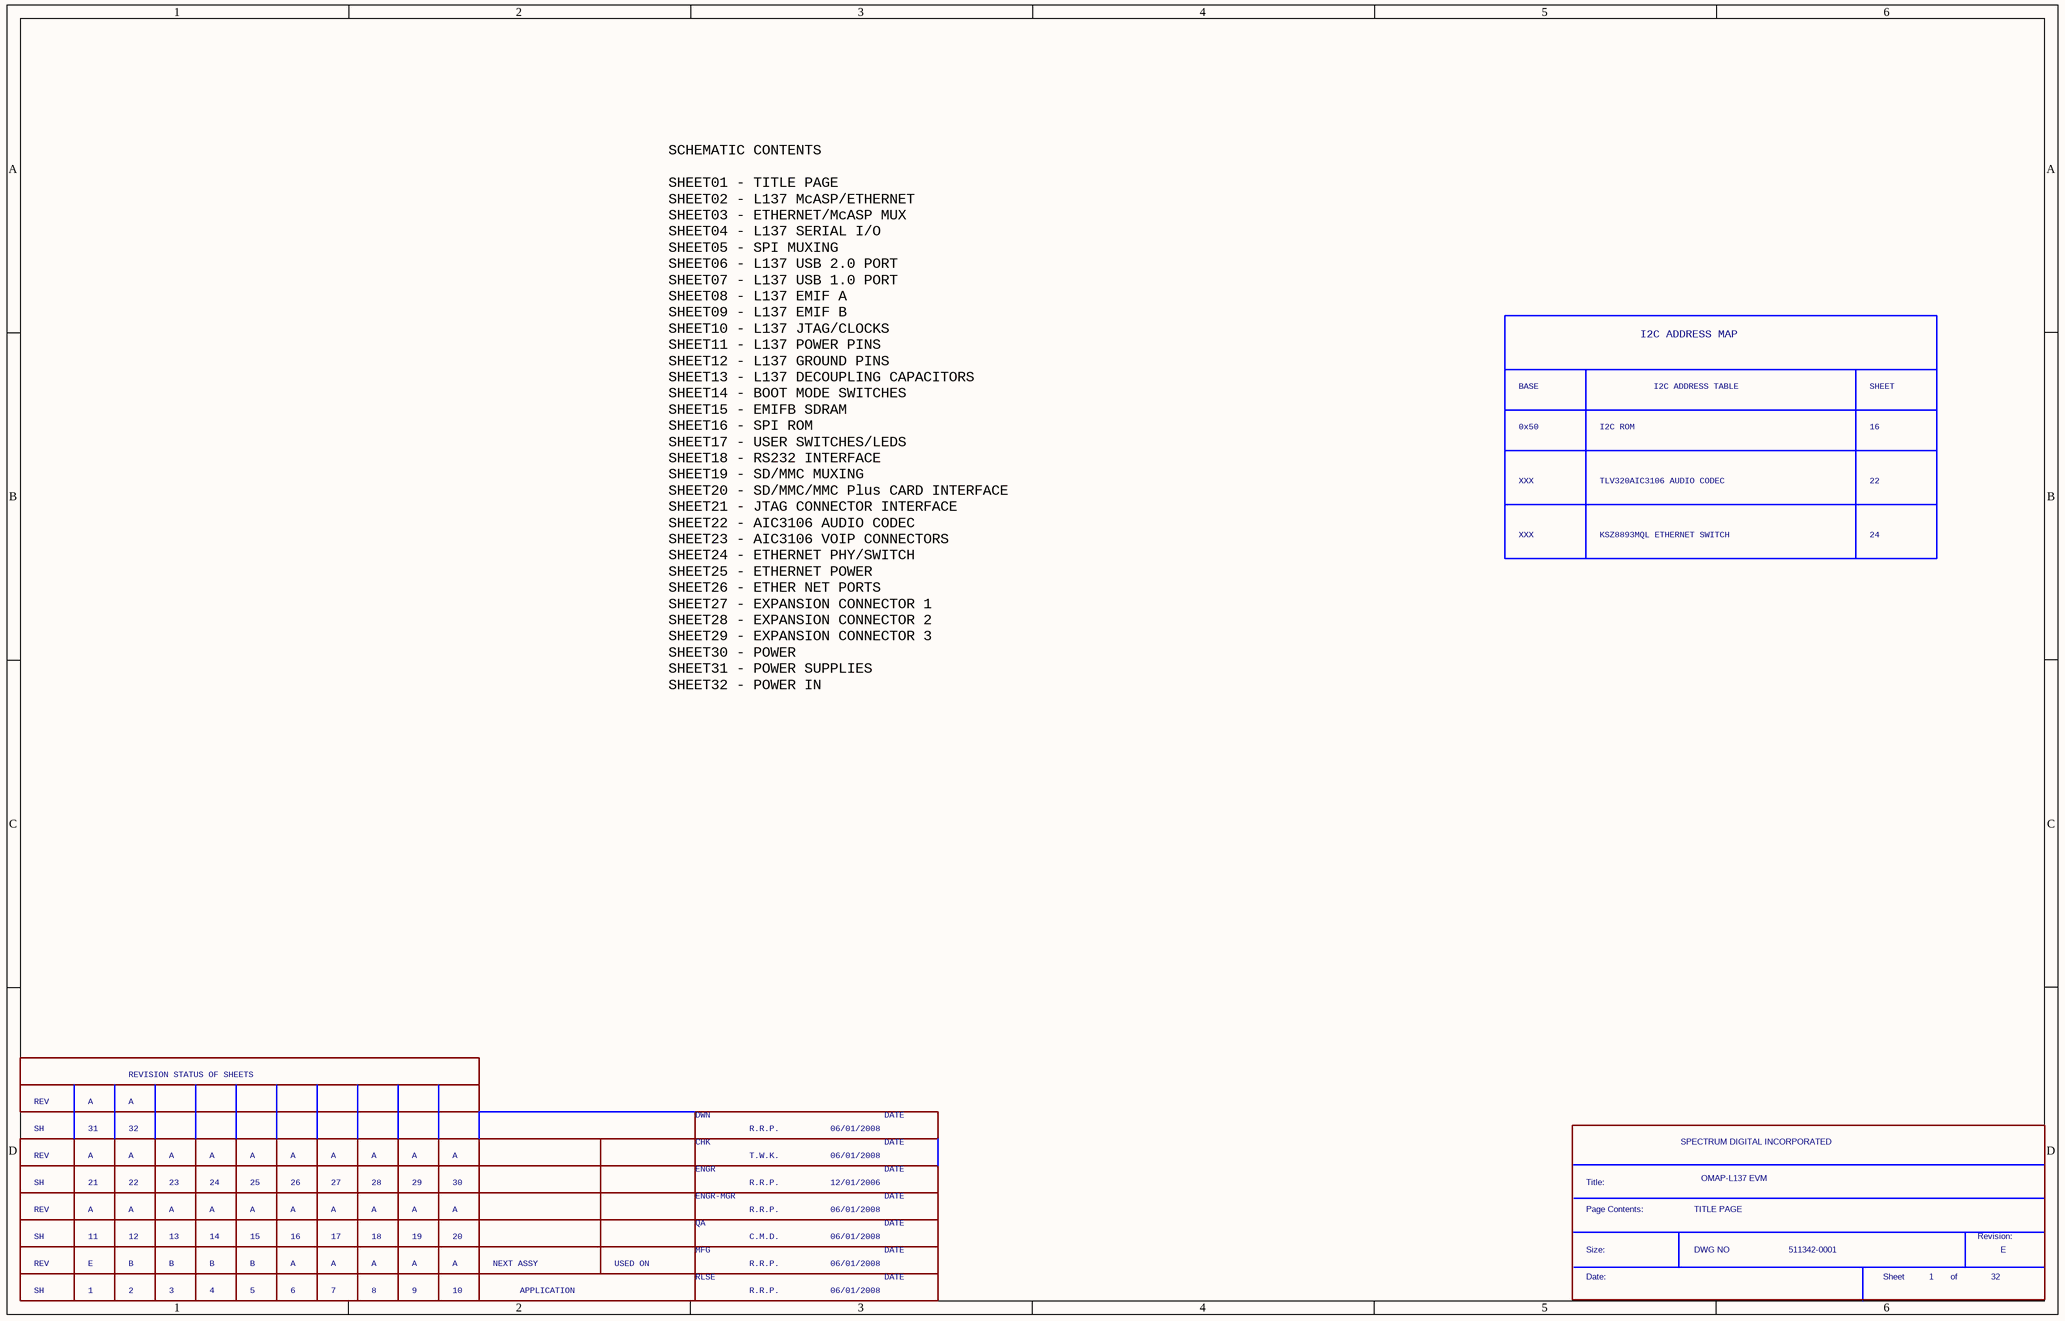
[diagram p31: SH01 - TITLE PAGE.SchDoc]

### Parts
(Parts that share a designator on the sheet are numbered #1, #2 ... from top to bottom, then left to right.)
*#32  Page Contents:: TITLE PAGE  RevCode: E  Title: OMAP-L137 EVM  OrgName: SPECTRUM DIGITAL INCORPORATED  Doc: 511342-0001  Page Number: 1  Page Count: 32  (hidden comment: SDTitleBlock)  (graphical)

### Notes on the sheet
- SCHEMATIC CONTENTS
  SHEET01 - TITLE PAGE
  SHEET02 - L137 McASP/ETHERNET
  SHEET03 - ETHERNET/McASP MUX
  SHEET04 - L137 SERIAL I/O
  SHEET05 - SPI MUXING
  SHEET06 - L137 USB 2.0 PORT
  SHEET07 - L137 USB 1.0 PORT
  SHEET08 - L137 EMIF A
  SHEET09 - L137 EMIF B
  SHEET10 - L137 JTAG/CLOCKS
  SHEET11 - L137 POWER PINS
  SHEET12 - L137 GROUND PINS
  SHEET13 - L137 DECOUPLING CAPACITORS
  SHEET14 - BOOT MODE SWITCHES
  SHEET15 - EMIFB SDRAM
  SHEET16 - SPI ROM
  SHEET17 - USER SWITCHES/LEDS
  SHEET18 - RS232 INTERFACE
  SHEET19 - SD/MMC MUXING
  SHEET20 - SD/MMC/MMC Plus CARD INTERFACE
  SHEET21 - JTAG CONNECTOR INTERFACE
  SHEET22 - AIC3106 AUDIO CODEC
  SHEET23 - AIC3106 VOIP CONNECTORS
  SHEET24 - ETHERNET PHY/SWITCH
  SHEET25 - ETHERNET POWER
  SHEET26 - ETHER NET PORTS
  SHEET27 - EXPANSION CONNECTOR 1
  SHEET28 - EXPANSION CONNECTOR 2
  SHEET29 - EXPANSION CONNECTOR 3
  SHEET30 - POWER
  SHEET31 - POWER SUPPLIES
  SHEET32 - POWER IN
- BASE
- I2C ADDRESS MAP
- I2C ADDRESS TABLE
- SHEET
- 0x50
- I2C ROM
- 16
- XXX
- TLV320AIC3106 AUDIO CODEC
- 22
- KSZ8893MQL ETHERNET SWITCH
- 24
- REV
- SH
- 31
- A
- REVISION STATUS OF SHEETS
- 32
- DWN
- R.R.P.
- 06/01/2008
- DATE
- 21
- 23
- 25
- 26
- 27
- 28
- 29
- 30
- ENGR
- ENGR-MGR
- CHK
- T.W.K.
- 12/01/2006
- 11
- E
- 12
- B
- 13
- 14
- 15
- 17
- 18
- 19
- 20
- NEXT ASSY
- USED ON
- MFG
- QA
- C.M.D.
- 1
- 2
- 3
- 4
- 5
- 6
- 7
- 8
- 9
- 10
- APPLICATION
- RLSE
- (in symbol SDTitleBlock) Title:; Page Contents:; Revision:; Size:; DWG NO; Date:; Sheet; of